# EAGLE design SenseBox-MCU-2-1 (EAGLE 9.6.2)

## Sheet 1 of 2
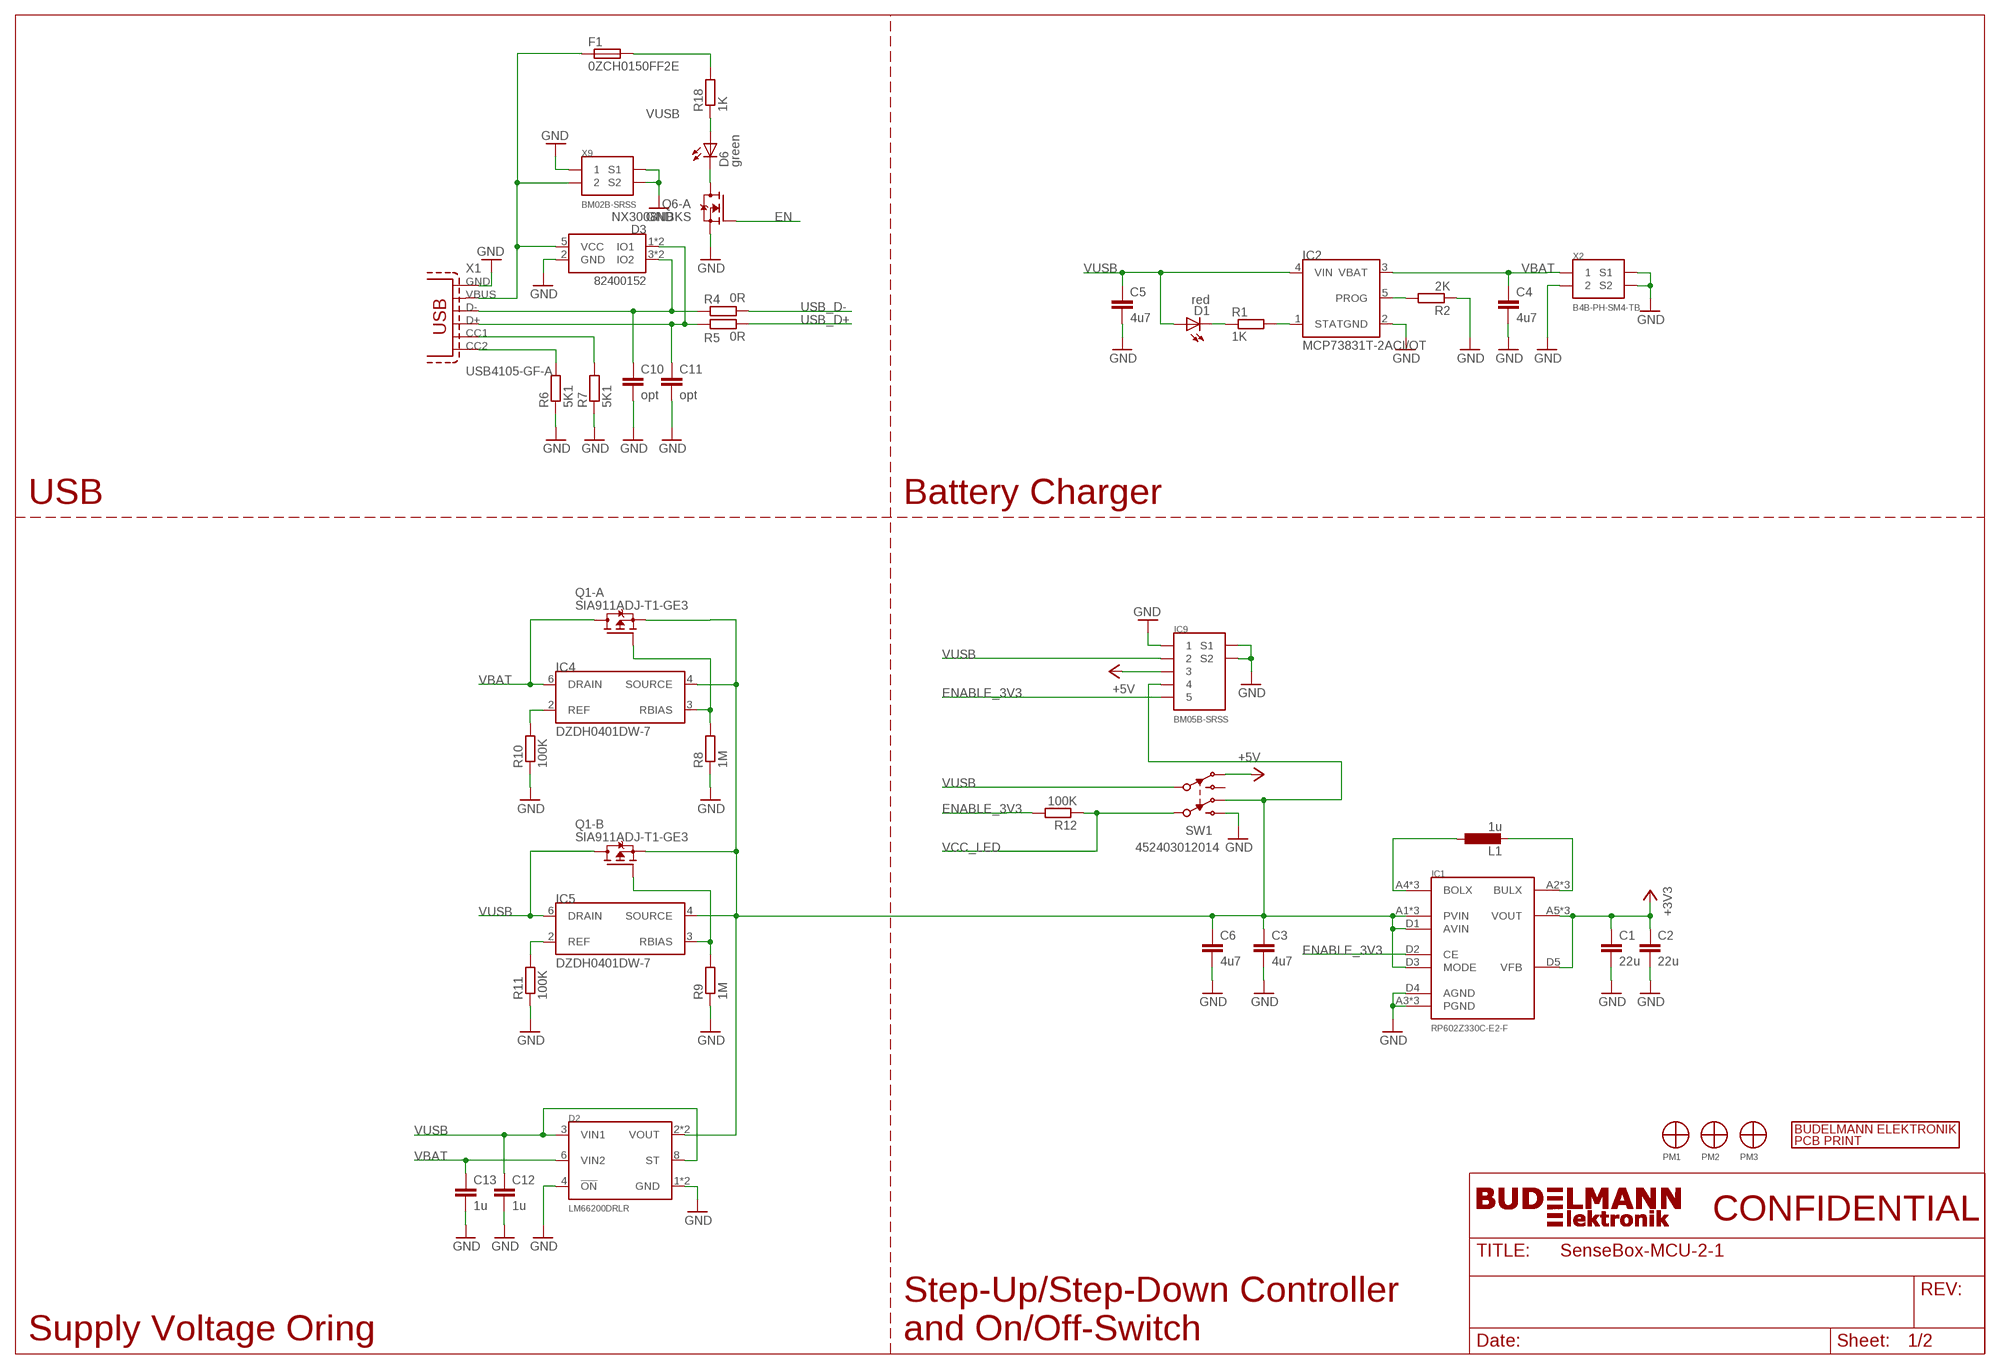
[diagram p0: schematic, sheet 1]

### Parts
C1  22u  C_22U_0805N  [0805N]
C2  22u  C_22U_0805N  [0805N]
C3  4u7  C_4U7_0603N  [0603N]
C4  4u7  C_4U7_0603N  [0603N]
C5  4u7  C_4U7_0603N  [0603N]
C6  4u7  C_4U7_0603N  [0603N]
C10  opt  C_0402N  [0402N]
C11  opt  C_0402N  [0402N]
C12  1u  C_1U_0402N  [0402N]
C13  1u  C_1U_0402N  [0402N]
D1  red  LED_RED_0603N  [0603N]
D2  LM66200DRLR  LM66200  [SOT-5X3]
D3  82400152  TVS-3-CHANNELS_WE-TVS_SOT563  [SOT563]
D6  green  LED_GREEN_0603N  [0603N]
F1  0ZCH0150FF2E  FUSE-2PIN_1.5A_1210N  [1210N]
IC1  RP602Z330C-E2-F  RP602_RP602Z330C-E2-F_WLCSP-20-P1  [WLCSP-20-P1]
IC2  MCP73831T-2ACI/OT  MCP73831_MCP73831T-2ACI/OT_SOT23-5  [SOT23-5]
IC4  DZDH0401DW-7  DZDH0401DW  [SOT363]
IC5  DZDH0401DW-7  DZDH0401DW  [SOT363]
IC9  BM05B-SRSS  SH-05_BM05B-SRSS_BM05B-SRSS  [BM05B-SRSS]
L1  1u  L_WE-LQS-1U_5040  [5040]
PM1  PM_ASSEMBLY  [PM1]
PM2  PM_ASSEMBLY  [PM1]
PM3  PM_ASSEMBLY  [PM1]
Q1  SIA911ADJ-T1-GE3  MOSFET-P-DUAL_SIA911ADJ-T1-GE3_POWERPAK-SC70-6  [POWERPAK-SC70-6]
Q6  NX3008NBKS  MOSFET-N-DUAL_NX3008NBKS_SOT363  [SOT363]
R1  1K  R_1K_0402N  [0402N]
R2  2K  R_2K_0402N  [0402N]
R4  0R  R_0R_0402N  [0402N]
R5  0R  R_0R_0402N  [0402N]
R6  5K1  R_5K1_0402N  [0402N]
R7  5K1  R_5K1_0402N  [0402N]
R8  1M  R_1M_0402N  [0402N]
R9  1M  R_1M_0402N  [0402N]
R10  100K  R_100K_0402N  [0402N]
R11  100K  R_100K_0402N  [0402N]
R12  100K  R_100K_0402N  [0402N]
R18  1K  R_1K_0402N  [0402N]
SW1  452403012014  DPDT_WS-SLSV  [WS-SLSV]
U$3  BE_LOGO_10MM_T  [BE_TOP_10MM]
X1  USB4105-GF-A  USB-C-2.0_USB4105-GF-A_USB4105  [USB4105]
X2  B4B-PH-SM4-TB  SH-02_B4B-PH-SM4-TB_B4B-PH-SM4-TB  [B4B-PH-SM4-TB]
X9  BM02B-SRSS  SH-02_BM02B-SRSS_BM02B-SRSS  [BM02B-SRSS]

### Nets
+3V3: C1.1 C2.1 IC1.A5(VOUT) IC1.B5(VOUT) IC1.C5(VOUT) IC1.D5(VFB) ; also sheet 2
+5V: IC9.3 SW1.3(NC1)
EN: Q6.2(-A:G) ; also sheet 2
ENABLE_3V3: IC1.D2(CE) IC9.5 R12.2
GND: C1.2 C2.2 C3.2 C4.2 C5.2 C6.2 C10.2 C11.2 C12.2 C13.2 D2.1(GND) D2.4(!ON) D2.5(GND) D3.2(GND) IC1.A3(PGND) IC1.B3(PGND) IC1.C3(PGND) IC1.D4(AGND) IC2.2(GND) IC9.1 IC9.S1 IC9.S2 Q6.1(-A:S) R2.1 R6.1 R7.1 R8.1 R9.1 R10.1 R11.1 SW1.4(NO2) X1.A1_B12(GND) X1.B1_A12(GND) X1.S1(GND) X1.S2(GND) X1.S3(GND) X1.S4(GND) X2.2 X2.SH1(S1) X2.SH2(S2) X9.1 X9.S1 X9.S2 ; also sheet 2
N$1: IC1.A4(BOLX) IC1.B4(BOLX) IC1.C4(BOLX) L1.1
N$2: IC1.A2(BULX) IC1.B2(BULX) IC1.C2(BULX) L1.2
N$4: IC2.5(PROG) R2.2
N$6: IC4.2(REF) R10.2
N$7: D1.C R1.1
N$8: IC2.1(STAT) R1.2
N$9: C10.1 D3.3(IO2) D3.4(IO2) R4.1 X1.A7(D-) X1.B7(D-)
N$10: C11.1 D3.1(IO1) D3.6(IO1) R5.1 X1.A6(D+) X1.B6(D+)
N$11: R6.2 X1.B5(CC2)
N$12: R7.2 X1.A5(CC1)
N$13: D3.5(VCC) F1.1 X1.A4_B9(VBUS) X1.B4_A9(VBUS) X9.2
N$14: IC5.2(REF) R11.2
N$15: IC4.3(RBIAS) Q1.2(-A:G) R8.2
N$16: C3.1 C6.1 D2.2(VOUT) D2.7(VOUT) IC1.A1(PVIN) IC1.B1(PVIN) IC1.C1(PVIN) IC1.D1(AVIN) IC1.D3(MODE) IC4.4(SOURCE) IC5.4(SOURCE) IC9.4 Q1.1(-A:S) Q1.4(-B:S) SW1.6(NC2)
N$17: IC5.3(RBIAS) Q1.5(-B:G) R9.2
N$27: D6.A R18.1
N$42: D6.C Q6.6(-A:D)
USB_D+: R5.2 ; also sheet 2
USB_D-: R4.2 ; also sheet 2
VBAT: C4.1 C13.1 D2.6(VIN2) IC2.3(VBAT) IC4.6(DRAIN) Q1.6(-A:D) Q1.7(-A:D) X2.1
VCC_LED: R12.1 SW1.5(C2) ; also sheet 2
VUSB: C5.1 C12.1 D1.A D2.3(VIN1) D2.8(ST) F1.2 IC2.4(VIN) IC5.6(DRAIN) IC9.2 Q1.3(-B:D) Q1.8(-B:D) R18.2 SW1.2(C1)
Unconnected: SW1.1(NO1)

### Notes on the sheet
- USB | Battery Charger
- Supply Voltage Oring
- Step-Up/Step-Down Controller 
  and On/Off-Switch

## Sheet 2 of 2
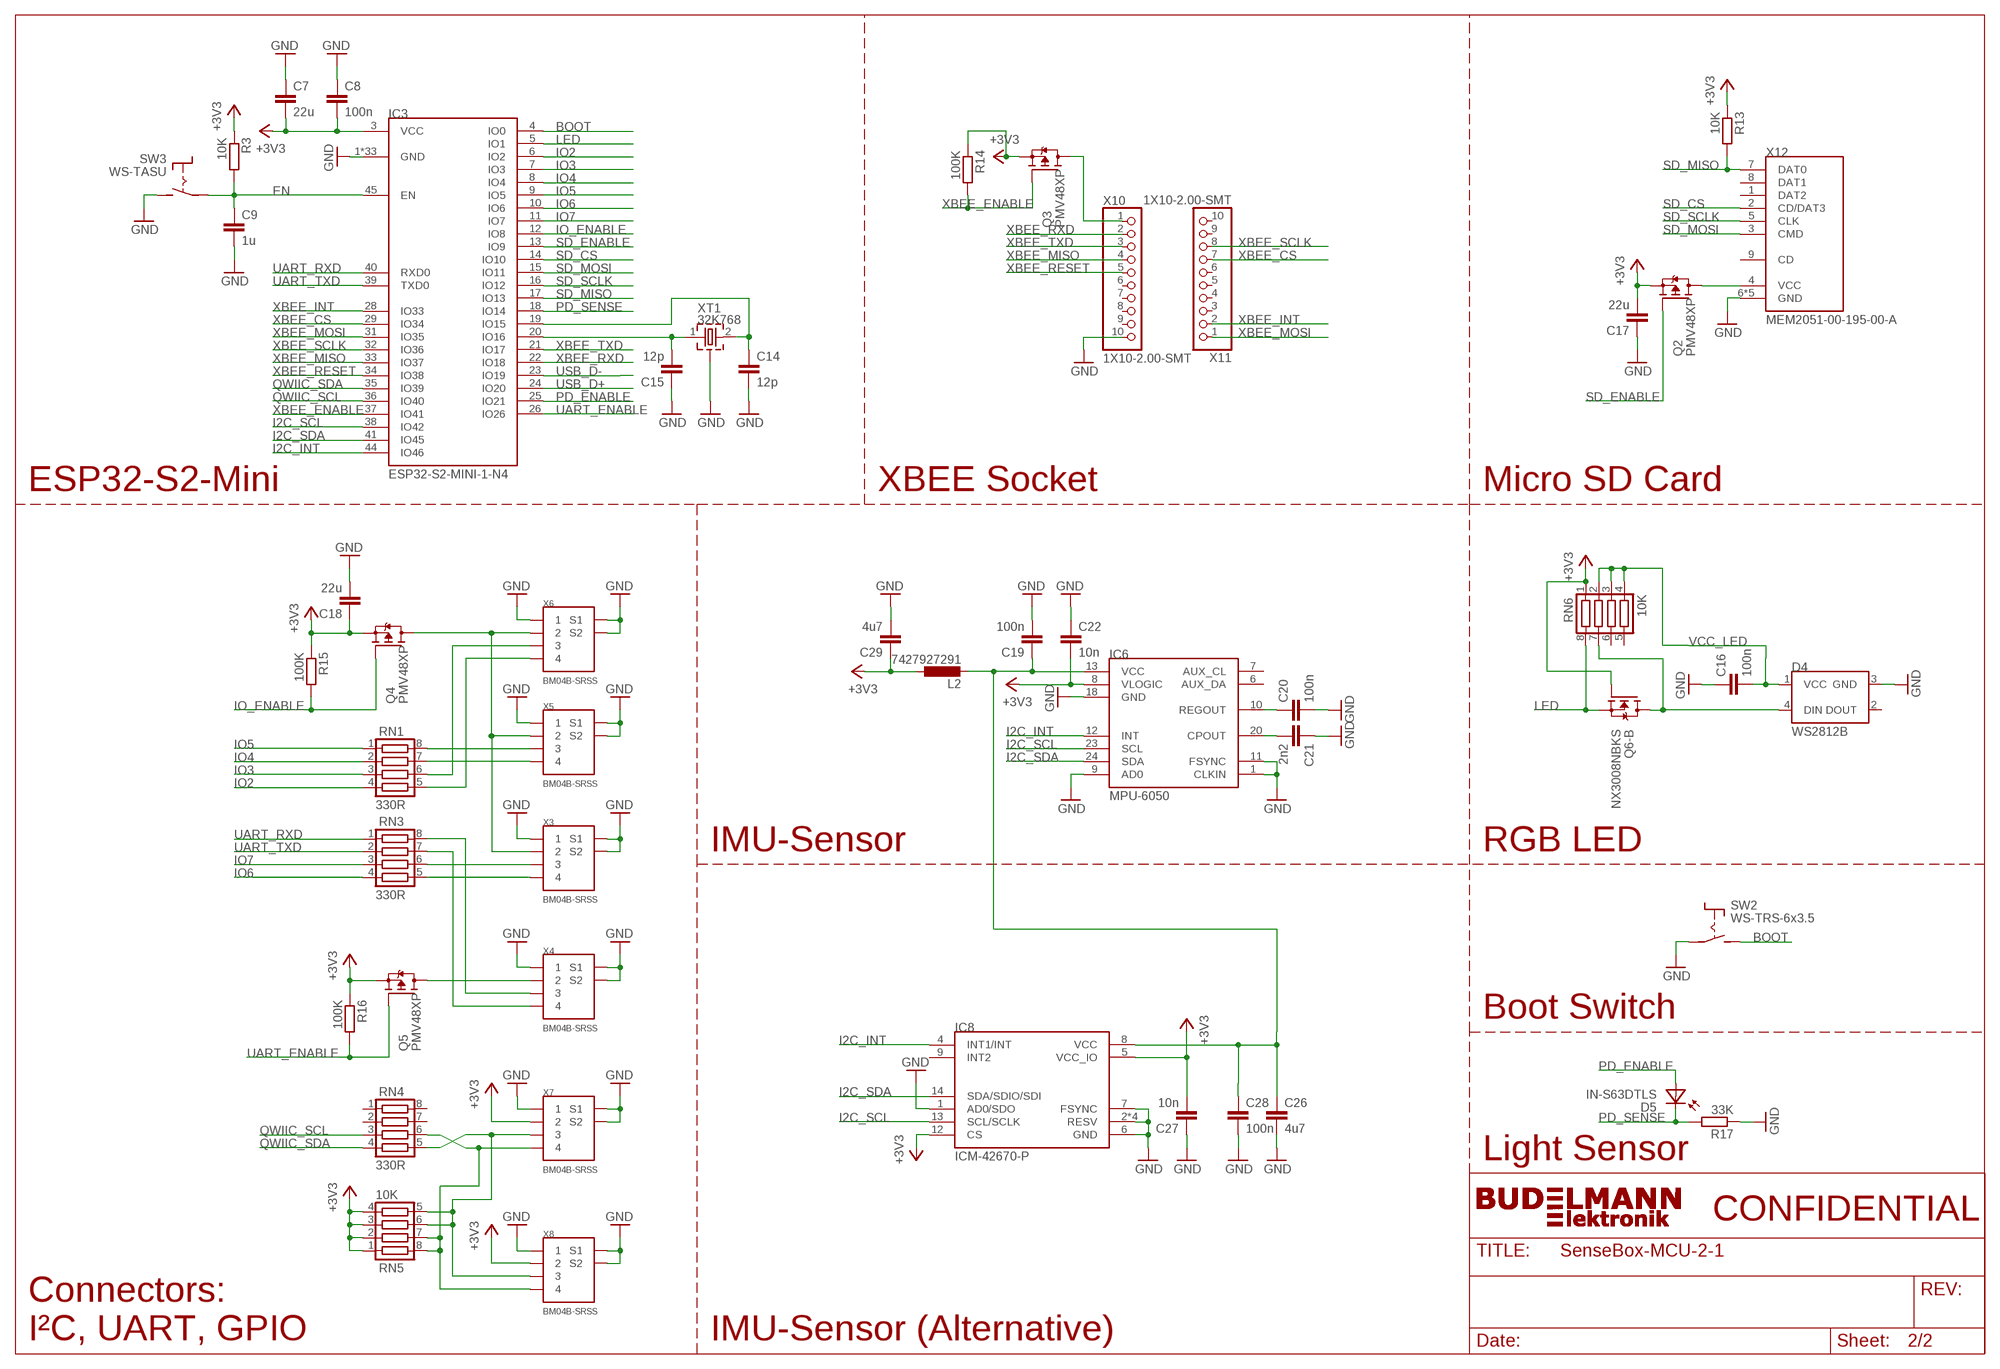
[diagram p1: schematic, sheet 2]

### Parts
C7  22u  C_22U_0805N  [0805N]
C8  100n  C_100N_0402N  [0402N]
C9  1u  C_1U_0402N  [0402N]
C14  12p  C_12P_0402N  [0402N]
C15  12p  C_12P_0402N  [0402N]
C16  100n  C_100N_0402N  [0402N]
C17  22u  C_22U_0805N  [0805N]
C18  22u  C_22U_0805N  [0805N]
C19  100n  C_100N_0402N  [0402N]
C20  100n  C_100N_0402N  [0402N]
C21  2n2  C_2N2_0402N  [0402N]
C22  10n  C_10N_0402N  [0402N]
C26  4u7  C_4U7_0603N  [0603N]
C27  10n  C_10N_0402N  [0402N]
C28  100n  C_100N_0402N  [0402N]
C29  4u7  C_4U7_0603N  [0603N]
D4  WS2812B  LED-ADRESSABLE_WS2812B_5050  [5050]
D5  IN-S63DTLS  PHOTODIODE_IN-S63DTLS_0603N  [0603N]
IC3  ESP32-S2-MINI-1-N4  ESP32-S2-MINI_ESP32-S2-MINI-1-N4_ESP32-S2-MINI  [ESP32-S2-MINI]
IC6  MPU-6050  [QFN24_4X4]
IC8  ICM-42670-P  ICM-42670-P_LGA14_2.5X3  [LGA14_2.5X3]
L2  7427927291  L_WE-CBF-7427927291_0402N  [0402N]
Q2  PMV48XP  MOSFET-P_PMV48XP_SOT23'  [SOT23]
Q3  PMV48XP  MOSFET-P_PMV48XP_SOT23'  [SOT23]
Q4  PMV48XP  MOSFET-P_PMV48XP_SOT23'  [SOT23]
Q5  PMV48XP  MOSFET-P_PMV48XP_SOT23'  [SOT23]
R3  10K  R_10K_0402N  [0402N]
R13  10K  R_10K_0402N  [0402N]
R14  100K  R_100K_0402N  [0402N]
R15  100K  R_100K_0402N  [0402N]
R16  100K  R_100K_0402N  [0402N]
R17  33K  R_33K_0402N  [0402N]
RN1  330R  RN4_330R_CAY16  [CAY16]
RN3  330R  RN4_330R_CAY16  [CAY16]
RN4  330R  RN4_330R_CAY16  [CAY16]
RN5  10K  RN4_10K_CAY16  [CAY16]
RN6  10K  RN4_10K_CAY16  [CAY16]
SW2  WS-TRS-6x3.5  TACTILE_SWITCH_WS-TRS-6X3.5  [WS-TRS-6X3.5]
SW3  WS-TASU  TACTILE_SWITCH_WS-TASU  [WS-TASU]
X3  BM04B-SRSS  SH-04_BM04B-SRSS_BM04B-SRSS  [BM04B-SRSS]
X4  BM04B-SRSS  SH-04_BM04B-SRSS_BM04B-SRSS  [BM04B-SRSS]
X5  BM04B-SRSS  SH-04_BM04B-SRSS_BM04B-SRSS  [BM04B-SRSS]
X6  BM04B-SRSS  SH-04_BM04B-SRSS_BM04B-SRSS  [BM04B-SRSS]
X7  BM04B-SRSS  SH-04_BM04B-SRSS_BM04B-SRSS  [BM04B-SRSS]
X8  BM04B-SRSS  SH-04_BM04B-SRSS_BM04B-SRSS  [BM04B-SRSS]
X10  1X10-2.00-SMT  1X10_2.00-SMT  [1X10-2.00-SMD]
X11  1X10-2.00-SMT  1X10_2.00-SMT  [1X10-2.00-SMD]
X12  MEM2051-00-195-00-A  SD-CARD2_MEM2051  [MEM2051]
XT1  32K768  CRYSTAL-1GND_1.4X1.5X5.2  [1.4X1.5X5.2]

### Nets
+3V3: C7.2 C8.2 C17.2 C18.1 C22.2 C27.2 C29.1 IC3.3(VCC) IC6.8(VLOGIC) IC8.5(VCC_IO) IC8.12(CS) L2.1 Q2.2(S) Q3.2(S) Q4.2(S) Q5.2(S) Q6.5(-B:G) R3.1 R13.1 R14.1 R15.1 R16.1 RN5.1 RN5.2 RN5.3 RN5.4 RN6.1 X7.2 X8.2 ; also sheet 1
BOOT: IC3.4(IO0) SW2.2(S)
EN: C9.1 IC3.45(EN) R3.2 SW3.1(P) SW3.3(P) ; also sheet 1
GND: C7.1 C8.1 C9.2 C14.2 C15.1 C16.1 C17.1 C18.2 C19.2 C20.2 C21.1 C22.1 C26.2 C27.1 C28.2 C29.2 D4.3(GND) IC3.1(GND) IC3.2(GND) IC3.30(GND) IC3.42(GND) IC3.43(GND) IC3.46(GND) IC3.47(GND) IC3.48(GND) IC3.49(GND) IC3.50(GND) IC3.51(GND) IC3.52(GND) IC3.53(GND) IC3.54(GND) IC3.55(GND) IC3.56(GND) IC3.57(GND) IC3.58(GND) IC3.59(GND) IC3.60(GND) IC3.61(GND) IC3.62(GND) IC3.63(GND) IC3.64(GND) IC3.65(GND) IC3.66(GND) IC3.67(GND) IC3.68(GND) IC3.69(GND) IC3.70(GND) IC3.71(GND) IC3.72(GND) IC3.73(GND) IC6.1(CLKIN) IC6.9(AD0) IC6.11(FSYNC) IC6.18(GND) IC8.1(AD0/SDO) IC8.2(RESV) IC8.3(RESV) IC8.6(GND) IC8.7(FSYNC) IC8.10(RESV) IC8.11(RESV) R17.1 SW2.1(P) SW3.2(S) SW3.4(S) X3.1 X3.S1 X3.S2 X4.1 X4.S1 X4.S2 X5.1 X5.S1 X5.S2 X6.1 X6.S1 X6.S2 X7.1 X7.S1 X7.S2 X8.1 X8.S1 X8.S2 X10.10 X12.6(GND) X12.S1(GND) X12.S2(GND) X12.S3(GND) X12.S4(GND) XT1.3(GND) ; also sheet 1
I2C_INT: IC3.44(IO46) IC6.12(INT) IC8.4(INT1/INT)
I2C_SCL: IC3.38(IO42) IC6.23(SCL) IC8.13(SCL/SCLK)
I2C_SDA: IC3.41(IO45) IC6.24(SDA) IC8.14(SDA/SDIO/SDI)
IO2: IC3.6(IO2) RN1.4
IO3: IC3.7(IO3) RN1.3
IO4: IC3.8(IO4) RN1.2
IO5: IC3.9(IO5) RN1.1
IO6: IC3.10(IO6) RN3.4
IO7: IC3.11(IO7) RN3.3
IO_ENABLE: IC3.12(IO8) Q4.1(G) R15.2
LED: IC3.5(IO1) Q6.4(-B:S) RN6.8
N$3: RN1.6 X6.3
N$5: C15.2 IC3.20(IO16) XT1.1
N$18: C14.1 IC3.19(IO15) XT1.2
N$19: D4.4(DIN) Q6.3(-B:D) RN6.7
N$20: Q4.3(D) X3.2 X5.2 X6.2
N$21: C20.1 IC6.10(REGOUT)
N$22: Q2.3(D) X12.4(VCC)
N$23: Q3.3(D) X10.1
N$24: Q5.3(D) X4.2
N$25: C21.2 IC6.20(CPOUT)
N$31: RN1.5 X6.4
N$32: RN1.8 X5.3
N$33: RN1.7 X5.4
N$34: RN3.5 X3.4
N$35: RN3.6 X3.3
N$36: RN3.8 X4.3
N$37: RN3.7 X4.4
N$38: RN4.6 RN5.7 RN5.8 X7.4 X8.4
N$39: RN4.5 RN5.5 RN5.6 X7.3 X8.3
N$41: C19.1 C26.1 C28.1 IC6.13(VCC) IC8.8(VCC) L2.2
PD_ENABLE: D5.A IC3.25(IO21)
PD_SENSE: D5.C IC3.18(IO14) R17.2
QWIIC_SCL: IC3.36(IO40) RN4.3
QWIIC_SDA: IC3.35(IO39) RN4.4
SD_CS: IC3.14(IO10) X12.2(CD/DAT3)
SD_ENABLE: IC3.13(IO9) Q2.1(G)
SD_MISO: IC3.17(IO13) R13.2 X12.7(DAT0)
SD_MOSI: IC3.15(IO11) X12.3(CMD)
SD_SCLK: IC3.16(IO12) X12.5(CLK)
UART_ENABLE: IC3.26(IO26) Q5.1(G) R16.2
UART_RXD: IC3.40(RXD0) RN3.1
UART_TXD: IC3.39(TXD0) RN3.2
USB_D+: IC3.24(IO20) ; also sheet 1
USB_D-: IC3.23(IO19) ; also sheet 1
VCC_LED: C16.2 D4.1(VCC) RN6.2 RN6.3 RN6.4 ; also sheet 1
XBEE_CS: IC3.29(IO34) X11.7
XBEE_ENABLE: IC3.37(IO41) Q3.1(G) R14.2
XBEE_INT: IC3.28(IO33) X11.2
XBEE_MISO: IC3.33(IO37) X10.4
XBEE_MOSI: IC3.31(IO35) X11.1
XBEE_RESET: IC3.34(IO38) X10.5
XBEE_RXD: IC3.22(IO18) X10.2
XBEE_SCLK: IC3.32(IO36) X11.8
XBEE_TXD: IC3.21(IO17) X10.3
Unconnected: D4.2(DOUT) IC6.6(AUX_DA) IC6.7(AUX_CL) IC8.9(INT2) RN4.1 RN4.2 RN4.7 RN4.8 RN6.5 RN6.6 X10.6 X10.7 X10.8 X10.9 X11.3 X11.4 X11.5 X11.6 X11.9 X11.10 X12.1(DAT2) X12.8(DAT1) X12.9(CD)

### Notes on the sheet
- ESP32-S2-Mini | XBEE Socket | Micro SD Card
- IMU-Sensor | RGB LED
- Boot Switch
- Light Sensor
- Connectors:
  I²C, UART, GPIO
- IMU-Sensor (Alternative)

## Library data of the parts
C1 C2 C7 C17 C18 = BE_capacitor:C: Capacitor; BE#: 208; DIELECTRIC: X5R; VOLTAGE: 6V3
C3-C6 C26 C29 = BE_capacitor:C: Capacitor; BE#: 284; DIELECTRIC: X5R; VOLTAGE: 6V3
C8 C16 C19 C20 C28 = BE_capacitor:C: Capacitor; BE#: 756; DIELECTRIC: X7R; VOLTAGE: 16
C9 C12 C13 = BE_capacitor:C: Capacitor; BE#: 901; DIELECTRIC: X5R; VOLTAGE: 10
C10 C11 = BE_capacitor:C: Capacitor; BE#: 0
C14 C15 = BE_capacitor:C: Capacitor; BE#: 754; DIELECTRIC: NPO; VOLTAGE: 50
C21 = BE_capacitor:C: Capacitor; BE#: 752; DIELECTRIC: X7R; VOLTAGE: 50
C22 C27 = BE_capacitor:C: Capacitor; BE#: 617; DIELECTRIC: X7R; VOLTAGE: 25
D1 = BE_opto:LED: Single LED; BE#: 224
D2 = BE_diode:LM66200: LM66200 1.6-5V, 2.5A Dual Ideal Diode with Automatic Switchover; BE#: 2291
D3 = BE_diode:TVS-3-CHANNELS: TVS Suppressor Diodes Array; BE#: 2015
D4 = BE_opto:LED-ADRESSABLE: Adressable LED with Data-In and Data-Out Pins; BE#: 2295
D5 = BE_opto:PHOTODIODE: Photo diode; BE#: 2296
D6 = BE_opto:LED: Single LED; BE#: 223
F1 = BE_fuse:FUSE-2PIN: Fuse with two Pins.; BE#: 2289; CURRENT: 1.5
IC1 = BE_dcdc:RP602: 1.5 A PWM/VFM Buck-Boost DC/DC Converter with Synchronous Rectifier; BE#: 2281
IC2 = BE_dcdc:MCP73831: Miniature Single-Cell, Fully Integrated Li-Ion, Li-Polymer Charge Management Controllers up to 500mA; BE#: 2283
IC3 = BE_wireless:ESP32-S2-MINI: 2.4 GHz Wi­Fi (802.11 b/g/n) module built around ESP32-S2 series of SoCs, Xtensa Single Core 32-bit LX7 Microprocessor; BE#: 2275
IC4 IC5 = BE_diode:DZDH0401DW: Ideal Diode Controller; BE#: 2290
IC6 = BE_sensor:MPU-6050: 6-Axis Inertial Measurement Unit Combining a 3-Axis Gyroscope and a 3-Axis Accelerometer; BE#: 2297
IC8 = BE_sensor:ICM-42670-P: high performance 6-axis MEMS MotionTracking IMU; BE#: 2357
IC9 = BE_connector:SH-05: SH Connector; BE#: 2369
L1 = BE_inductor:L: Inductor; BE#: 2282; CURRENT: 4.9; INDUCTANCE: 1u
L2 = BE_inductor:L: Inductor; BE#: 1925; CURRENT: 0.3
PM1-PM3 = BE_markers:PM: Passing Marker; BE#: 0
Q1 = BE_transistor:MOSFET-P-DUAL: Dual Mosfet with Common Drain Pins; BE#: 2292; CURRENT: 4.5; VOLTAGE: 20
Q2-Q5 = BE_transistor:MOSFET-P: Single P-Channel Mosfet; BE#: 271; CURRENT: 3.5; VOLTAGE: 20
Q6 = BE_transistor:MOSFET-N-DUAL: Dual Mosfet; BE#: 405; CURRENT: 0.35; POWER: 0.3; VOLTAGE: 30
R1 R18 = BE_resistor:R: Resistor; BE#: 1088; POWER: 0.063; TEMPERATURE_COEFFICIENT: 100; TOLERANCE: 1%; VOLTAGE: 50
R2 = BE_resistor:R: Resistor; BE#: 1057; POWER: 0.063; TEMPERATURE_COEFFICIENT: 100; TOLERANCE: 1%; VOLTAGE: 50
R3 R13 = BE_resistor:R: Resistor; BE#: 616; POWER: 0.063; TEMPERATURE_COEFFICIENT: 100; TOLERANCE: 1%; VOLTAGE: 50
R4 R5 = BE_resistor:R: Resistor; BE#: 1054
R6 R7 = BE_resistor:R: Resistor; BE#: 2285; POWER: 0.063; TEMPERATURE_COEFFICIENT: 100; TOLERANCE: 1%; VOLTAGE: 50
R8 R9 = BE_resistor:R: Resistor; BE#: 1089; POWER: 0.063; TEMPERATURE_COEFFICIENT: 100; TOLERANCE: 1%; VOLTAGE: 50
R10-R12 R14-R16 = BE_resistor:R: Resistor; BE#: 615; POWER: 0.063; TEMPERATURE_COEFFICIENT: 100; TOLERANCE: 1%; VOLTAGE: 50
R17 = BE_resistor:R: Resistor; BE#: 1428; POWER: 0.063; TEMPERATURE_COEFFICIENT: 100; TOLERANCE: 1%; VOLTAGE: 50
RN1 RN3 RN4 = BE_resistor:RN4: Quad Resistor Net; BE#: 483; POWER: 0.062; TOLERANCE: 5%; VOLTAGE: 50
RN5 RN6 = BE_resistor:RN4: Quad Resistor Net; BE#: 196; POWER: 0.062; TOLERANCE: 5%; VOLTAGE: 50
SW1 = BE_switch:DPDT: Switch - Double Pole, Double Throw; BE#: 2294
SW2 = BE_switch:TACTILE_SWITCH: Tactile Switch; BE#: 272
SW3 = BE_switch:TACTILE_SWITCH: Tactile Switch; BE#: 778
U$3 = BE_logo:BE_LOGO: Budelmann Elektronik Logo for pcb print in different sizes.; BE#: 0
X1 = BE_connector:USB-C-2.0: USB-C Connector with USB 2.0 Support; BE#: 2284
X2 = BE_connector:SH-02: SH Connector; BE#: 2370
X3-X8 = BE_connector:SH-04: SH Connector; BE#: 2287
X9 = BE_connector:SH-02: SH Connector; BE#: 2286
X10 X11 = BE_pinheader:1X10: Pin Header; BE#: 2288
X12 = BE_connector:SD-CARD2: SD Card with Card Detection (Single Pin Contacting GND); BE#: 2293
XT1 = BE_crystal:CRYSTAL-1GND: Crystal with one Ground Terminal; BE#: 830

## Board
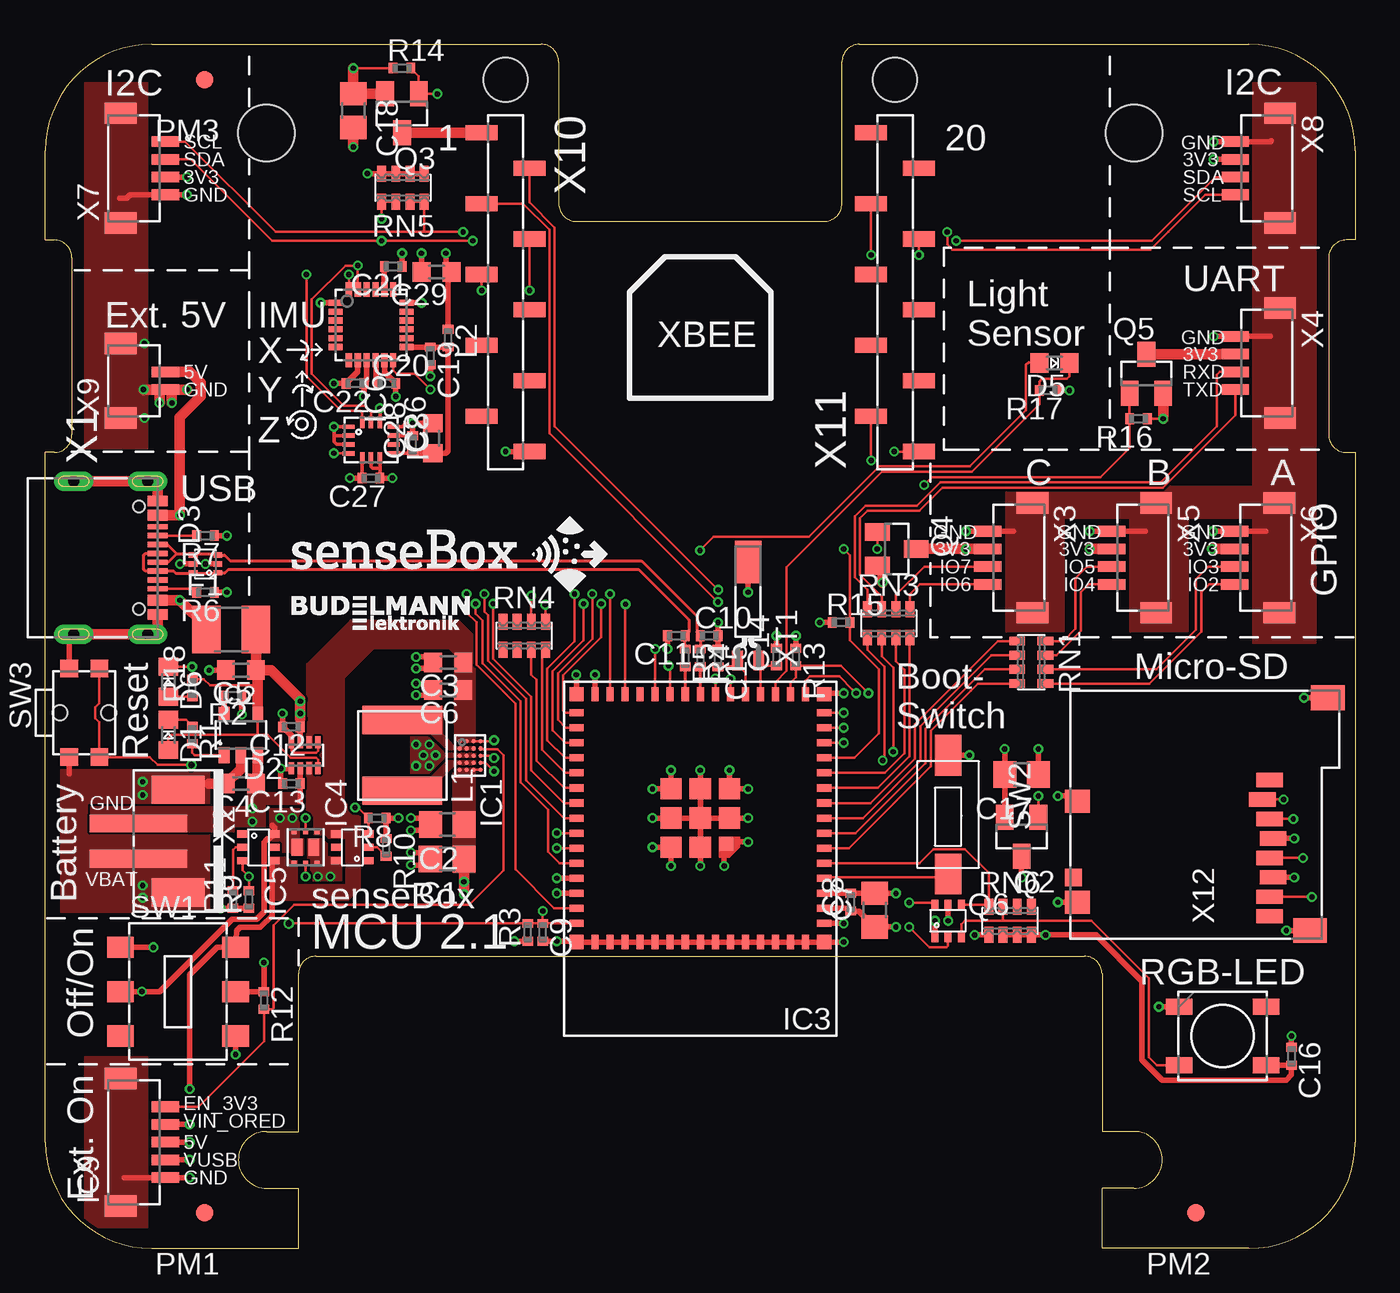
[diagram p2: board, top side]
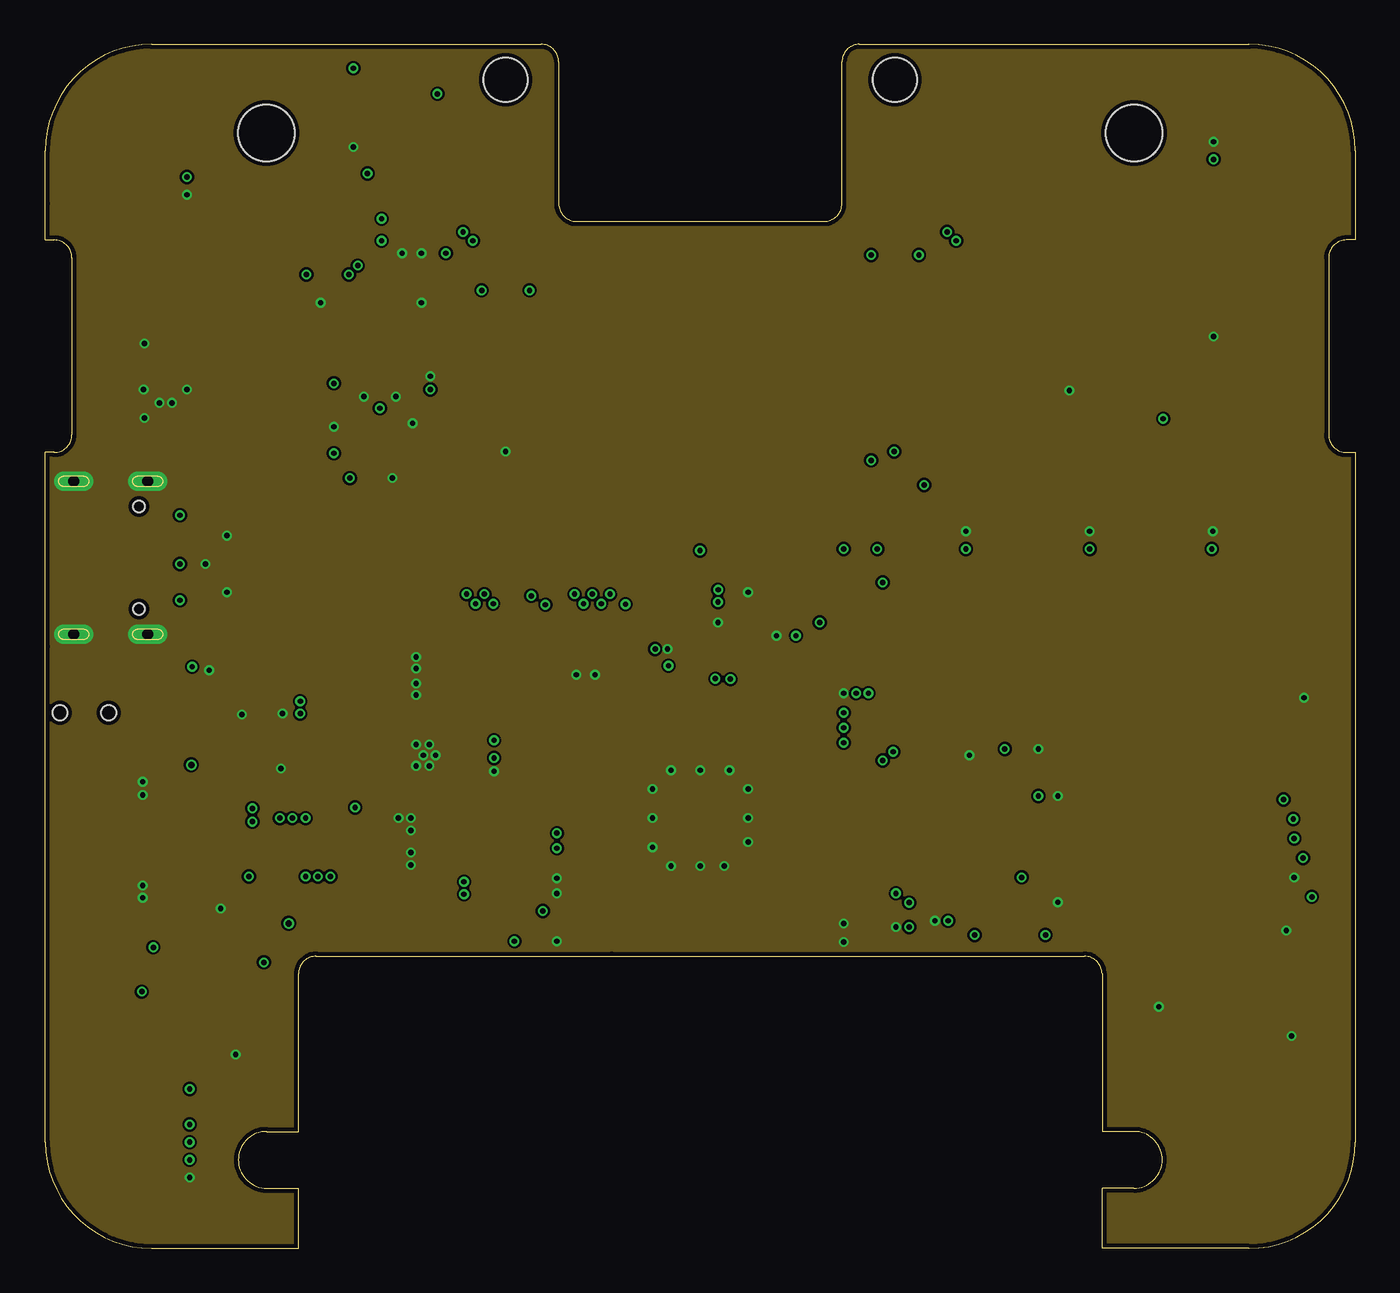
[diagram p3: board, inner layer Route2]
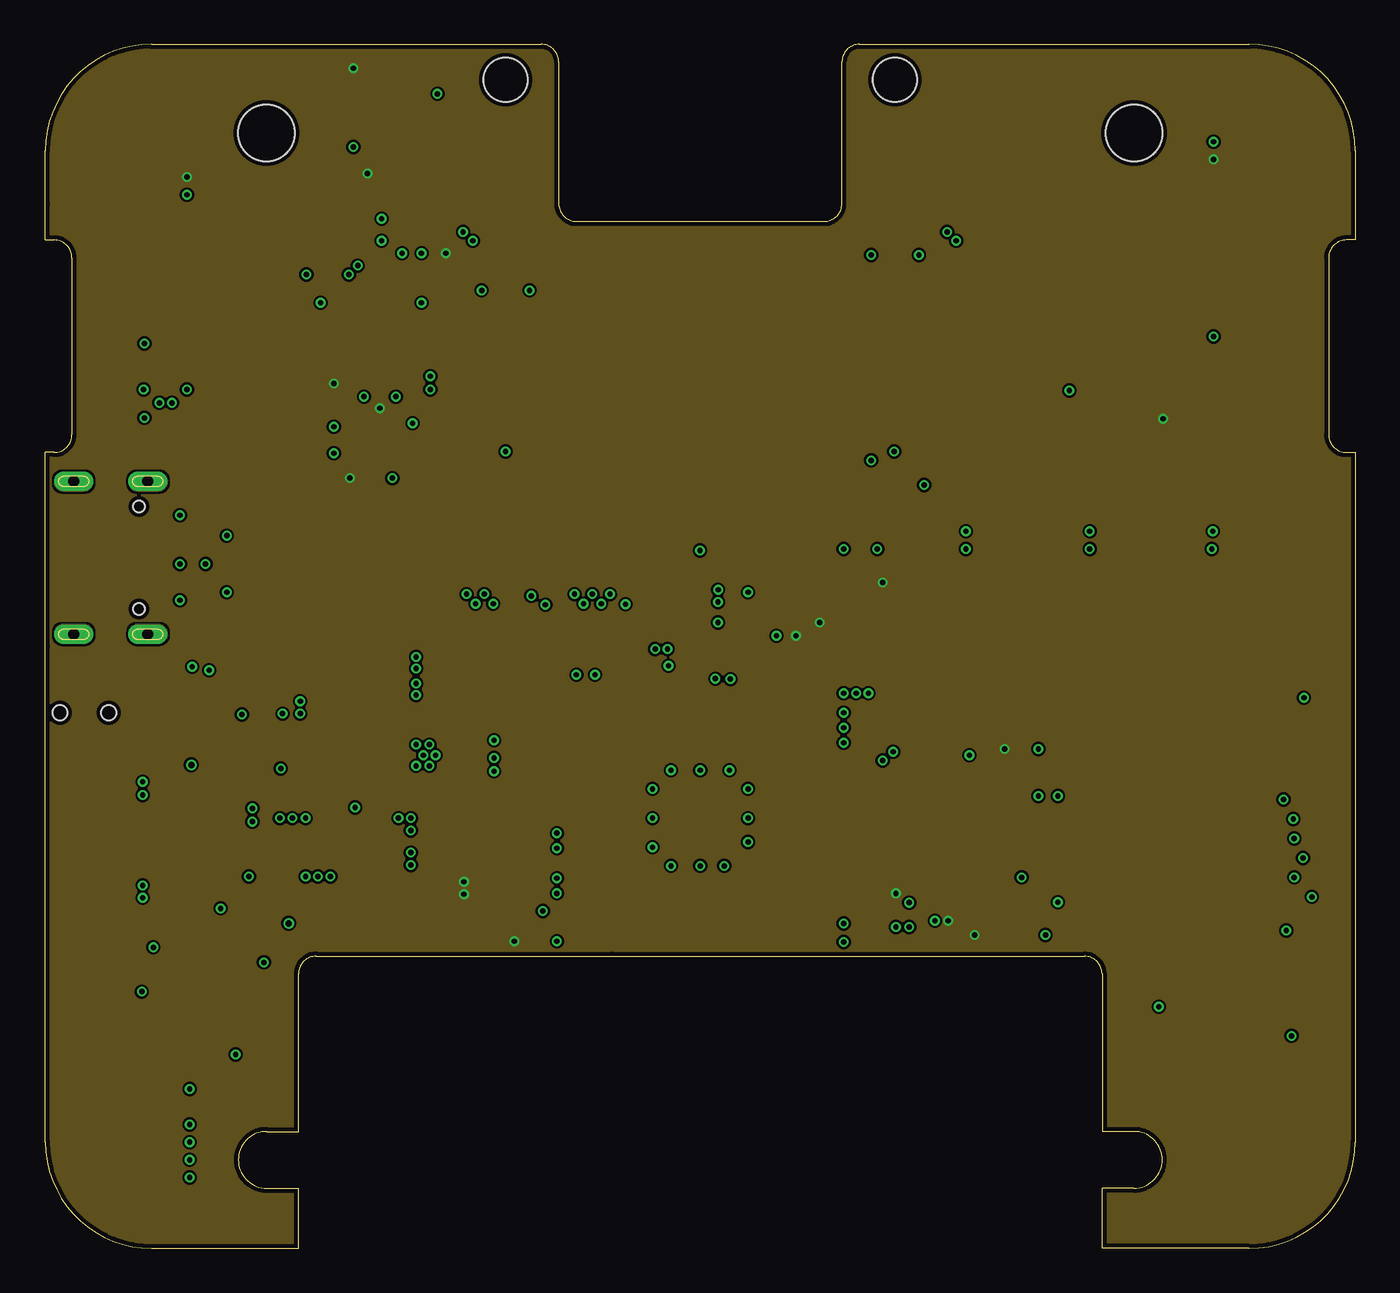
[diagram p4: board, inner layer Route15]
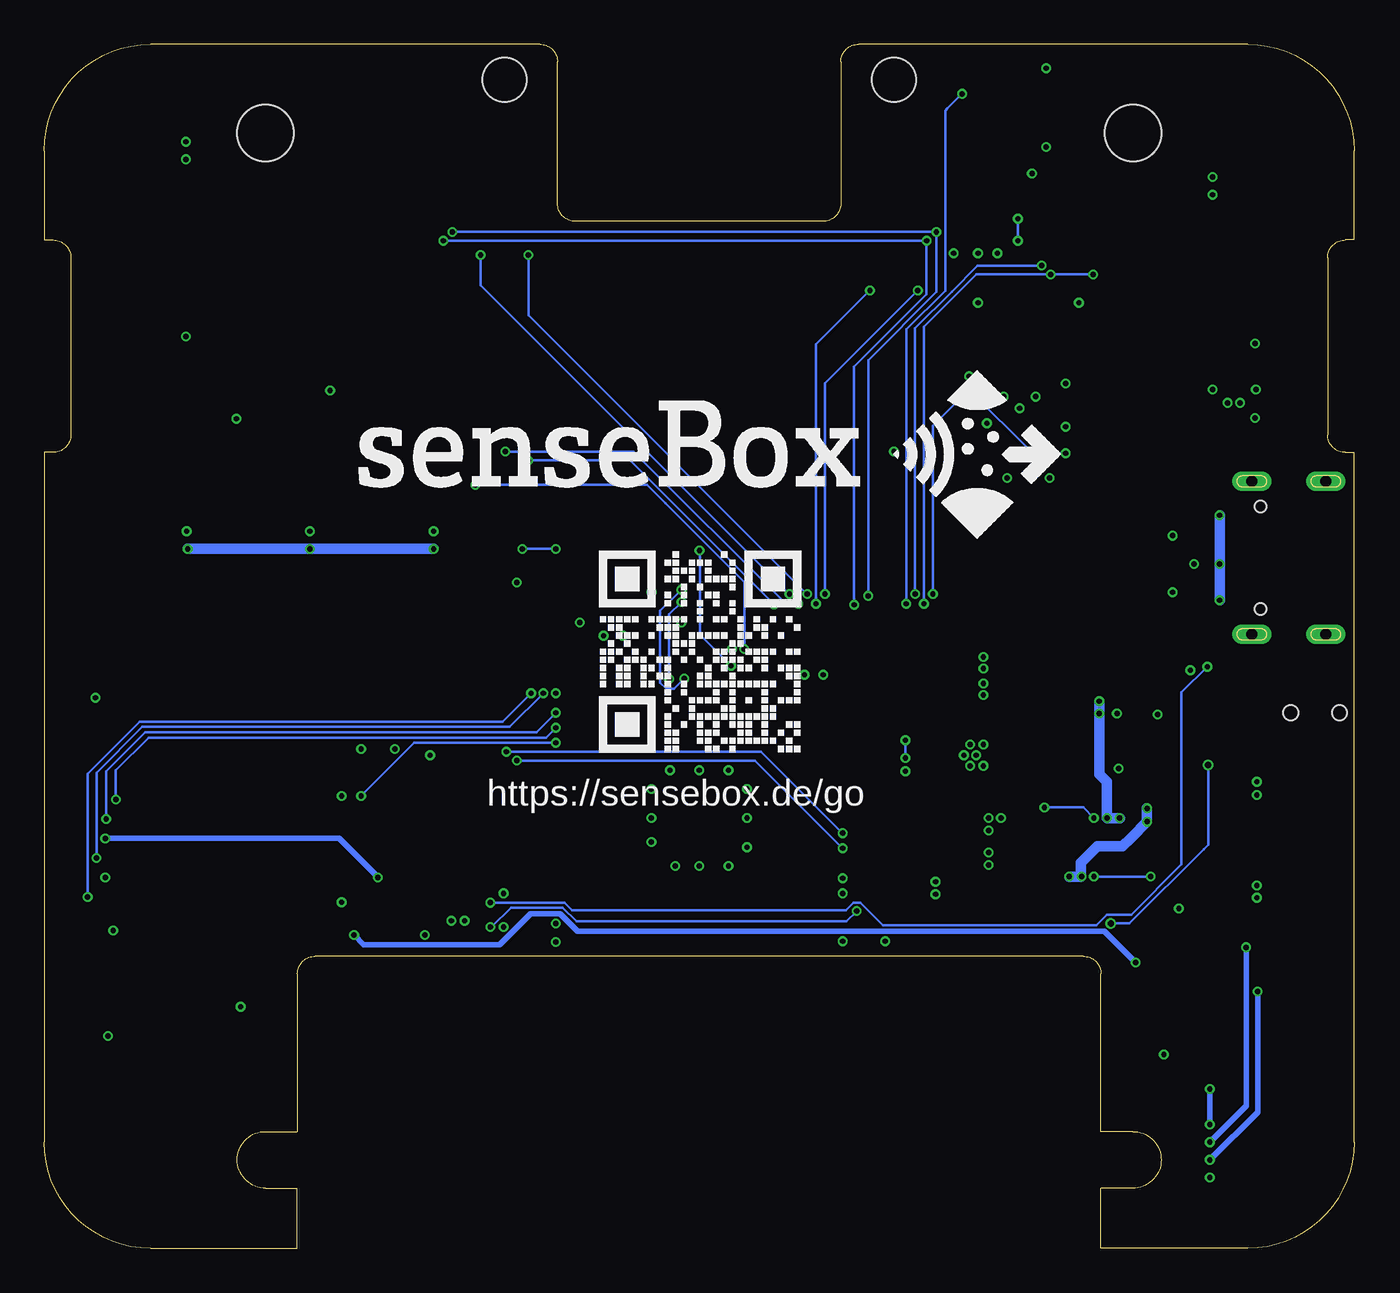
[diagram p5: board, bottom side, seen from below]

Size 74 x 68 mm. Coordinates in mm from the lower left corner, seen from the top.
Outline: 0,34 0,44.95 0.05,44.95 0.5,44.95 arc90 1.5,45.95 1.5,55.95 arc90 0.5,56.95 0,56.95 0,59 0,62 arc-90 6,68 28,68 arc-90 29,67 29,59 arc90 30,58 44,58 arc90 45,59 45,67 arc-90 46,68 68,68 arc-90 74,62 74,56.95 73.5,56.95 arc90 72.5,55.95 72.5,45.95 arc90 73.5,44.95 74,44.95 74,6 arc-90 68,0 59.7,0 59.7,3.4 61.5,3.4 arc90 63.1,5 arc90 61.5,6.6 59.7,6.6 59.7,15.5 arc90 58.7,16.5 32,16.5 15.3,16.5 arc90 14.3,15.5 14.3,6.6 12.5,6.6 arc90 10.9,5 arc90 12.5,3.4 14.3,3.4 14.3,0.1 14.3,0 10.55,0 6,0 arc-90 0,6 0,34
Copper layers (1+2*15+16): Top 0.035mm / dielectric 0.1mm / Route2 0.0175mm / dielectric 1.265mm / Route15 0.0175mm / dielectric 0.1mm / Bottom 0.035mm
Design rules "default *": minimum track width 0.125mm, minimum drill 0.3mm, track to track 0.125mm, track to pad 0.125mm, pad to pad 0.125mm, via to via 0.125mm, smd to smd 0.125mm, copper to edge 0.25mm, drill to drill 0.25mm, minimum pad ring 10mil, minimum via ring 0.125mm, stop-mask expansion 4mil, vias tented up to drill 0.4mm, thermal gap 0.125mm
Holes 3.2 mm at 12.5,63 61.5,63
Holes 2.5 mm at 48,66 26,66
tKeepout: area 9.5,60 to 15.5,66; area 58.5,60 to 64.5,66; area 58.5,2 to 64.5,8; area 9.5,2 to 15.5,8

### Footprints (pad centres in the part's own frame; a part is rotated, then mirrored left to right if it is on the bottom)
0805N = smd 1.3 x 1.5: 1 -0.95,0; 2 0.95,0
0603N = smd 1 x 1.1: 1 -0.85,0; 2 0.85,0
0402N = smd 0.5 x 0.6: 1 -0.5,0; 2 0.5,0
0603N' = smd 1 x 1.1: A 0.85,0; C -0.85,0
SOT-5X3 = smd 0.3 x 0.67: 1 -0.75,-0.74; 2 -0.25,-0.74; 3 0.25,-0.74; 4 0.75,-0.74; 5 0.75,0.74; 6 0.25,0.74; 7 -0.25,0.74; 8 -0.75,0.74
SOT563 = smd 0.3 x 0.5: 1 -0.5,-0.7; 2 0,-0.7; 3 0.5,-0.7; 4 0.5,0.7; 5 0,0.7; 6 -0.5,0.7
5050 = smd 0.9 x 1.5: 1 -1.65,-2.45; 2 1.65,-2.45; 3 1.65,2.45; 4 -1.65,2.45
1210N = smd 1.6 x 2.7: 1 -1.4,0; 2 1.4,0
WLCSP-20-P1 = smd 0.265 x 0.265: A1 -0.8,-0.6; A2 -0.4,-0.6; A3 0,-0.6; A4 0.4,-0.6; A5 0.8,-0.6; B1 -0.8,-0.2; B2 -0.4,-0.2; B3 0,-0.2; B4 0.4,-0.2; B5 0.8,-0.2; C1 -0.8,0.2; C2 -0.4,0.2; C3 0,0.2; C4 0.4,0.2; C5 0.8,0.2; D1 -0.8,0.6; D2 -0.4,0.6; D3 0,0.6; D4 0.4,0.6; D5 0.8,0.6
SOT23-5 = smd 0.6 x 0.9: 1 -0.95,-1.15; 2 0,-1.15; 3 0.95,-1.15; 4 0.95,1.15; 5 -0.95,1.15
ESP32-S2-MINI = smd 0.4 x 0.8: 1 -3.65,-7; 2 -2.8,-7; 3 -1.95,-7; 4 -1.1,-7; 5 -0.25,-7; 6 0.6,-7; 7 1.45,-7; 8 2.3,-7; 9 3.15,-7; 10 4,-7; 11 4.85,-7; 12 5.7,-7; 13 6.55,-7; 14 7.4,-7; 15 8.25,-7; 31 8.25,7; 32 7.4,7; 33 6.55,7; 34 5.7,7; 35 4.85,7; 36 4,7; 37 3.15,7; 38 2.3,7; 39 1.45,7; 40 0.6,7; 41 -0.25,7; 42 -1.1,7; 43 -1.95,7; 44 -2.8,7; 45 -3.65,7 | smd 0.8 x 0.4: 16 9.3,-5.95; 17 9.3,-5.1; 18 9.3,-4.25; 19 9.3,-3.4; 20 9.3,-2.55; 21 9.3,-1.7; 22 9.3,-0.85; 23 9.3,0; 24 9.3,0.85; 25 9.3,1.7; 26 9.3,2.55; 27 9.3,3.4; 28 9.3,4.25; 29 9.3,5.1; 30 9.3,5.95; 46 -4.7,5.95; 47 -4.7,5.1; 48 -4.7,4.25; 49 -4.7,3.4; 50 -4.7,2.55; 51 -4.7,1.7; 52 -4.7,0.85; 53 -4.7,0; 54 -4.7,-0.85; 55 -4.7,-1.7; 56 -4.7,-2.55; 57 -4.7,-3.4; 58 -4.7,-4.25; 59 -4.7,-5.1; 60 -4.7,-5.95 | smd 1.2 x 1.2: 61 2.3,0; 67 2.3,-1.65; 68 3.95,-1.65; 69 3.95,0; 70 3.95,1.65; 71 2.3,1.65; 72 0.65,1.65; 73 0.65,0 | smd 0.8 x 0.8: 62 -4.7,-7; 63 9.3,-7; 64 9.3,7; 65 -4.7,7; 66 0.85,-1.45
SOT363 = smd 0.4 x 0.6: 1 -0.75,-0.9; 2 0,-0.9; 3 0.75,-0.9; 4 0.75,0.9; 5 0,0.9; 6 -0.75,0.9
QFN24_4X4 = smd 0.35 x 0.8: 1 -1.25,-2; 2 -0.75,-2; 3 -0.25,-2; 4 0.25,-2; 5 0.75,-2; 6 1.25,-2; 13 1.25,2; 14 0.75,2; 15 0.25,2; 16 -0.25,2; 17 -0.75,2; 18 -1.25,2 | smd 0.8 x 0.35: 7 2,-1.25; 8 2,-0.75; 9 2,-0.25; 10 2,0.25; 11 2,0.75; 12 2,1.25; 19 -2,1.25; 20 -2,0.75; 21 -2,0.25; 22 -2,-0.25; 23 -2,-0.75; 24 -2,-1.25
LGA14_2.5X3 = smd 0.25 x 0.675: 1 -0.75,-1.265; 2 -0.25,-1.265; 3 0.25,-1.265; 4 0.75,-1.265; 8 0.75,1.265; 9 0.25,1.265; 10 -0.25,1.265; 11 -0.75,1.265 | smd 0.675 x 0.25: 5 1.015,-0.5; 6 1.015,0; 7 1.015,0.5; 12 -1.015,0.5; 13 -1.015,0; 14 -1.015,-0.5
BM05B-SRSS = smd 0.6 x 1.55: 1 -2,-1.775; 2 -1,-1.775; 3 0,-1.775; 4 1,-1.775; 5 2,-1.775 | smd 1.2 x 1.8: S1 -3.6,0.75; S2 3.6,0.75
5040 = smd 1.6 x 4.5: 1 -2,0; 2 2,0
PM1 = smd 1 x 1: P$1 0,0
POWERPAK-SC70-6 = smd 0.3 x 0.325: 1 -0.65,-0.912; 2 0,-0.912; 3 0.65,-0.912; 4 0.65,0.912; 5 0,0.912; 6 -0.65,0.912 | smd 0.613 x 0.95: 7 -0.467,0; 8 0.467,0
SOT23 = smd 1 x 1.4: 1 -0.95,-1.1; 2 0.95,-1.1; 3 0,1.1
CAY16 = smd 0.5 x 0.9: 1 -1.2,-0.8; 2 -0.4,-0.8; 3 0.4,-0.8; 4 1.2,-0.8; 5 1.2,0.8; 6 0.4,0.8; 7 -0.4,0.8; 8 -1.2,0.8
WS-SLSV = smd 1.5 x 1.2: 1 -3.25,-2.5; 2 -3.25,0; 3 -3.25,2.5; 4 3.25,-2.5; 5 3.25,0; 6 3.25,2.5
WS-TRS-6X3.5 = smd 2.3 x 1.5: 1 -3.35,0; 2 3.35,0
WS-TASU = smd 1 x 1: 1 2.5,0.85; 2 2.5,-0.85; 3 -2.5,0.85; 4 -2.5,-0.85 | hole 0.85: 0,-1.375; 0,1.375
USB4105 = smd 0.6 x 1.15: A1_B12 3.2,-3.35; A4_B9 2.4,-3.35; B1_A12 -3.2,-3.35; B4_A9 -2.4,-3.35 | smd 0.3 x 1.15: A5 1.25,-3.35; A6 0.25,-3.35; A7 -0.25,-3.35; A8 -1.25,-3.35; B5 -1.75,-3.35; B6 -0.75,-3.35; B7 0.75,-3.35; B8 1.75,-3.35 | drill 0.6 pad 1 long: S1 -4.32,-2.78; S2 4.32,-2.78; S3 4.32,1.4; S4 -4.32,1.4 | hole 0.65: -2.89,-2.28; 2.89,-2.28
B4B-PH-SM4-TB = smd 1 x 5.5: 1 -1,-2.25; 2 1,-2.25 | smd 1.6 x 3: SH1 -2.9,0; SH2 2.9,0
BM04B-SRSS = smd 0.6 x 1.55: 1 -1.5,-1.775; 2 -0.5,-1.775; 3 0.5,-1.775; 4 1.5,-1.775 | smd 1.2 x 1.8: S1 -3.1,0.75; S2 3.1,0.75
BM02B-SRSS = smd 0.6 x 1.55: 1 -0.5,-1.775; 2 0.5,-1.775 | smd 1.2 x 1.8: S1 -2.1,0.75; S2 2.1,0.75
1X10-2.00-SMD = smd 0.86 x 1.8: 1 -9,-1.35; 2 -7,1.35; 3 -5,-1.35; 4 -3,1.35; 5 -1,-1.35; 6 1,1.35; 7 3,-1.35; 8 5,1.35; 9 7,-1.35; 10 9,1.35
MEM2051 = smd 0.8 x 1.5: 1 1.95,-4.15; 2 0.85,-3.75; 3 -0.25,-4.15; 4 -1.35,-4.35; 5 -2.45,-4.15; 6 -3.55,-4.35; 7 -4.65,-4.15; 8 -5.75,-4.15 | smd 1 x 0.95: 9 -3.55,6.925 | smd 1.4 x 1.9: S1 6.6,-7.45; S2 -6.55,-6.45 | smd 1.3 x 1.4: S3 0.75,6.7; S4 -4.95,6.7
1.4X1.5X5.2 = smd 0.6 x 1.1: 1 -0.6,0; 2 0.6,0 | smd 1.5 x 2.4: 3 0,5.55

### Placement (x,y rotation side)
C1  22.7,21.98 180 top
C2  22.71,23.93 180 top
C3  22.76,33.08 180 top
C4  11.05,26.25 180 top
C5  11.05,32.65 180 top
C6  22.75,31.53 180 top
C7  46.85,19.1 90 top
C8  45.5,19.55 90 top
C9  28.1,17.85 270 top
C10  37.5,34.6 0 top
C11  35.65,34.6 180 top
C12  13.9,29.45 180 top
C13  13.9,26.25 180 top
C14  41.3,33.4 90 top
C15  38,33.35 270 top
C16  70.4,10.85 270 top
C17  55.15,26.75 180 top
C18  17.4,64.25 270 top
C19  21.75,50.4 270 top
C20  19.3,48.85 0 top
C21  19.65,55.45 180 top
C22  17.5,48.85 180 top
C26  21.9,45.75 90 top
C27  18.4,43.5 180 top
C28  20.75,45.4 90 top
C29  22.1,55.15 180 top
D1  red  [0603N']  6.95,29 270 top
D2  14.65,27.85 180 top
D3  9.05,38.65 90 top
D4  66.5,12 90 top
D5  IN-S63DTLS  [0603N']  57,50 180 top
D6  green  [0603N']  6.95,32 270 top
F1  10.5,34.95 0 top
IC1  24,27.83 270 top
IC2  11.05,29 0 top
IC3  37,22 90 top
IC4  17.35,22.65 90 top
IC5  12.05,22.65 270 top
IC6  18.4,52.15 270 top
IC8  18.4,45.65 270 top
IC9  5,6 90 top
L1  20.17,27.84 90 top
L2  22.75,51.4 270 top
PM1  9,2 0 top
PM2  65,2 0 top
PM3  9,66 0 top
Q1  14.7,22.65 180 top
Q2  55.15,23.25 180 top
Q3  20.15,64.1 180 top
Q4  48.1,39.5 270 top
Q5  62.2,49.4 0 top
Q6  51,18.5 0 top
R1  8.3,29 270 top
R2  10.6,31.2 180 top
R3  27.25,17.85 90 top
R4  37,33.35 270 top
R5  36.15,33.35 270 top
R6  9.05,37.05 180 top
R7  9.05,40.25 180 top
R8  18.75,24.3 180 top
R9  11.5,19.7 90 top
R10  19.25,22.65 270 top
R11  10.6,19.7 90 top
R12  12.35,14 270 top
R13  42.4,33.4 270 top
R14  20.15,66.65 0 top
R15  44.95,35.35 0 top
R16  61.75,46.85 180 top
R17  56.65,48.45 180 top
R18  8.3,31.65 90 top
RN1  55.7,33.1 270 top
RN3  47.65,35.3 0 top
RN4  27.05,34.6 0 top
RN5  20.2,59.9 180 top
RN6  54.5,18.5 0 top
SW1  7.5,14.5 0 top
SW2  51,24.5 270 top
SW3  2.2,30.25 270 top
U$3  13.85,34.85 0 top
X1  3,39 90 top
X2  7.5,23 270 top
X3  55,39 270 top
X4  69,50 270 top
X5  62,39 270 top
X6  68.95,39 270 top
X7  5,61 90 top
X8  69,61 270 top
X9  5,49 90 top
X10  26,54 270 top
X11  48,54 90 top
X12  65,24.5 90 top
XT1  39.7,33.2 0 top

### Tracks (layer width: path | path; a pad name or v marks a point on that pad's centre or on a via)
+3V3  (via drill 0.3)
  Top 0.15: IC1.D5 IC1.C5 | R14.1 v17.4,66.65 | R16.1 v63.15,46.85
  Top 0.2: IC8.12 v18.9,47.45 | IC8.5 C27.2
  Top 0.3: v48.05,20.05 C7.2 C8.2 IC3.3 | R3.1 v26.5,17.35 | v42.4,34.6 R13.1 | Q2.2 C17.2 v54.2,28.2 | R15.1 v43.75,35.35 | X7.2 v8,60.5 | X8.2 v66,61.5 | RN5.1 RN5.2 RN5.3 RN5.4 v18.2,60.7 | v16.3,48.85 C22.2 17.65,49.5 IC6.8 | L2.1 22.75,54.95 C29.1 22.62,55.48 v22.62,56.2 | C27.2 v17.2,43.5 | RN6.1 v52.5,17.7 | Q6.5 v51,18.5
  Top 0.6: Q3.2 C18.1 v17.4,66.65 | Q5.2 v63.15,46.85 | C1.1 v23.65,20.7 v23.65,20 | Q4.2 47.3,38.25 v47.3,37.6
  pour Top (no thermals): 23.05,21.25 23.05,26.8 23.32,27.07 24.25,27.07 24.25,21.25
  pour Route15 (rank 2): 0,71 74,71 74,-3 0,-3
+5V  (via drill 0.3)
  Top 0.3: SW1.3 v6.1,17 | IC9.3 v8.15,6
  Bottom 0.3: v8.15,6 6.1,8.05 v6.1,17
BOOT
  Top 0.15: IC3.4 44.05,20.95 50.8,20.95 SW2.2
EN  (via drill 0.3, 0.35)
  Top 0.15: IC3.45 C9.1 | C9.1 R3.2 | Q6.2 51,17.1 50.9,17 49.95,17 v48.8,18.15 | v28.1,19.05 C9.1
  Top 0.152: SW3.3 3.05,30.79 2.82,30.56 2.82,29.94 3.05,29.71 SW3.1 5.9,27.75 6.35,27.3 v8.25,27.3 | v13.75,18.35 R3.2
  Bottom 0.15: v48.8,18.15 48.72,18.15 47.62,19.25 44.73,19.25 43.94,18.46 28.69,18.46 v28.1,19.05 | 8.5,22.55 8.25,22.8 v8.25,27.3
  Bottom 0.152: v13.75,18.35 12.7,18.35 8.5,22.55
ENABLE_3V3
  Top 0.15: IC1.D2 24.63,28.2 25.55,28.2 25.9,27.85 25.9,21.35 23.95,19.4 14.06,19.4 12.9,18.24 12.9,13.6 12.8,13.5 R12.2 12.35,11.7 8.65,8 IC9.5
GND  (via drill 0.3)
  Top 0.15: D2.1 15.4,28.1 15.3,28 14,28 13.9,28.1 D2.4 | IC1.D4 24.87,27.43 v25.35,26.95
  Top 0.2: C27.1 18.9,44 18.9,44.05 | 18.9,44.05 IC8.7 | IC8.6 18.4,44.15 18.5,44.05 18.9,44.05 | IC8.1 v16.3,46.4 16.3,45.9 | IC8.3 16.45,45.4 16.3,45.55 16.3,45.9 | IC8.2 16.3,45.9 | IC8.10 C28.2 | IC8.11 20.15,46.4 20.35,46.6 v20.75,46.6
  Top 0.3: IC3.2 45.35,19.2 C8.1 45.95,19.05 46.73,18.27 | 46.73,18.27 C7.1 | v48.05,18.15 C7.1 | C7.1 46.73,18.27 | IC3.1 v45.1,18.35 | v45.1,17.3 IC3.62 IC3.60 IC3.59 IC3.58 IC3.57 IC3.56 IC3.55 IC3.54 IC3.53 IC3.52 IC3.51 IC3.50 IC3.49 IC3.48 IC3.47 IC3.46 IC3.65 29.95,17.35 v28.9,17.35 C9.2 | IC3.42 v28.9,20.9 | IC3.43 v28.9,20.05 | IC3.64 v30,32.4 | IC3.30 v31.05,32.4 | IC3.63 44.05,31.35 v45.1,31.35 | D4.3 v62.9,13.65 | C17.1 v56.1,28.2 | X12.S3 58,25.55 v57.2,25.55 | X12.S4 v57.2,19.55 | SW2.1 v52.2,27.85 | X12.6 v70.55,20.95 | X12.S2 v70.1,17.95 | C16.1 v70.4,12 | X12.S1 v71.1,31.1 | C15.1 C10.2 v38,35.35 | C11.2 v35.15,33.85 | XT1.3 v39.7,37.05 | R17.1 v57.85,48.45 | IC6.9 18.15,49 C22.1 18,48.3 v18,48.1 | IC6.11 19.18,50.12 19.18,49.48 C20.2 v19.8,48.1 | C19.2 v21.75,49.25 | C21.1 v20.15,56.2 | IC6.18 v21.25,53.4 | IC6.1 v15.55,53.4 | C14.2 v41.3,34.6 | v52,40.5 X3.1 54.7,40.5 | v59,40.5 X5.1 62.15,40.5 | v65.95,40.5 X6.1 68.95,40.5 | X10.10 v26,45 | v8,59.5 X7.1 4.8,59.5 4.6,59.3 4.2,59.3 | v66,62.5 X8.1 69.2,62.5 69.25,62.55 | R7.1 v10.25,40.25 | R6.1 v10.25,37.05 | v9.25,32.65 C5.2 | R2.1 v11.1,30.15 | C13.2 13.3,26.35 v13.3,27.1 D2.5 | D2.4 13.9,28.95 C12.2 v13.4,30.2 | SW1.4 v10.75,10.95 | v20.95,31.9 21.53,31.9 C6.2 21.62,31.25 v20.95,31.25 | v20.95,32.75 21.58,32.75 C3.2 21.59,33.4 v20.95,33.4 | v20.65,22.35 21.38,22.35 C1.2 21.42,21.65 v20.65,21.65 | v20.65,24.3 21.39,24.3 C2.2 21.43,23.6 v20.65,23.6 | 69.2,51.5 X4.1 v66,51.5 | SW3.4 1.35,34.43 X1.S4 | SW3.2 1.35,26.8 | v35.35,27 IC3.70 34.35,25.95 v34.3,25.95 | v34.3,24.3 34.35,24.3 IC3.71 IC3.61 | v34.3,22.65 IC3.72 35.35,21.65 v35.35,21.6 | v37,21.6 IC3.73 IC3.61 | v38.35,21.6 38.35,22.75 IC3.66 38.6,22.95 v39.7,22.95
  Top 0.3: v39.7,24.3 IC3.67 IC3.61 | v38.65,27 IC3.68 v39.7,25.95 | v37,27 IC3.69 IC3.61 | R10.1 R8.1 v19.95,24.3 | D3.2 v9.05,38.65 | v21.25,56.2 C29.2 | v8.15,4 IC9.1 4.45,4 | C28.2 20.75,46.55 v20.75,46.6 C26.2 | C27.1 v19.6,43.5 | Q6.1 v50.25,18.5 | v9.9,19.2 R11.1 R9.1
  Top 0.6: 6.5,48.5 X9.1 7.15,48.5 | 6.5,48.5 v5.55,48.5 | v8,48.5 7.15,48.5 | v7.15,47.75 7.15,48.5 | v6.45,47.75 6.45,48.45 6.5,48.5 | X1.A1_B12 6.35,43.32 X1.S2 X1.S3 | X1.B1_A12 6.35,34.68 X1.S1 X1.S4 | C18.2 v17.4,62.2 | IC2.2 11.05,27.1 C4.2 9.25,26.25
  other vias: 22.05,27.85 21.35,27.85 21.7,28.45 21.7,27.25 20.95,27.25 20.95,28.45 5.6,46.9 5.6,51.1 5.5,20.5 5.5,25.6 5.5,26.35 5.5,19.8
  pour Top (rank 2, no thermals): 24.3,26.77 24.3,28.9 20.65,28.9 20.65,26.77
  pour Route2 (no thermals): 0,71 74,71 74,-3 0,-3
  pour Top (no thermals): 2.25,65.8 5.75,65.8 5.75,45.2 2.25,45.2
  pour Top (no thermals): 71.75,34.2 68.25,34.2 68.25,41.25 64.5,41.25 64.5,34.85 61.3,34.85 61.3,41.25 57.5,41.25 57.5,34.85 54.3,34.85 54.3,43 68.25,43 68.25,65.8 71.75,65.8
  pour Top (no thermals): 2.25,10.8 5.75,10.8 5.75,1.2 2.25,1.2
  pour Top (rank 2, no thermals): 0.9,27 9.25,27 9.25,19 0.9,19
  pour Route15 (no thermals): 1.6,43.8 1.05,43.8 arc90 0.55,43.3 arc90 1.05,42.8 1.6,42.8 2.15,42.8 arc90 2.65,43.3 arc90 2.15,43.8
  pour Route15 (no thermals): 5.8,43.8 5.25,43.8 arc90 4.75,43.3 arc90 5.25,42.8 5.8,42.8 6.35,42.8 arc90 6.85,43.3 arc90 6.35,43.8
  pour Route15 (no thermals): 5.8,35.2 5.25,35.2 arc90 4.75,34.7 arc90 5.25,34.2 5.8,34.2 6.35,34.2 arc90 6.85,34.7 arc90 6.35,35.2
  pour Route15 (no thermals): 1.6,35.2 1.05,35.2 arc90 0.55,34.7 arc90 1.05,34.2 1.6,34.2 2.15,34.2 arc90 2.65,34.7 arc90 2.15,35.2
I2C_INT  (via drill 0.3)
  Top 0.15: v23.8,36.95 23.8,35.9 24.35,35.35 24.35,32.95 26.55,30.75 26.55,21.4 28.75,19.2 IC3.44 | v21.75,48.5 20.85,49.4 19.85,49.4 19.65,49.6 IC6.12 | IC8.4 v16.3,44.9
  Bottom 0.15: v23.8,36.95 23.8,46.45 v21.75,48.5 18.15,44.9 v16.3,44.9
I2C_SCL  (via drill 0.3)
  Top 0.15: IC3.38 29.3,24.3 27.15,26.45 27.15,31.03 25,33.18 25,35.75 24.8,35.95 v24.8,36.95 | IC6.23 v17.65,55.5 16.95,55.5 15.05,53.6 15.05,49.4 16.85,47.6 18,47.6 18.4,47.2 IC8.13
  Bottom 0.15: v24.8,36.95 24.8,51.97 22.73,54.03 21.27,55.5 v17.65,55.5
I2C_SDA  (via drill 0.3)
  Top 0.15: IC3.41 29.04,21.75 28.4,22.39 28.4,24.78 26.85,26.33 26.85,30.9 24.7,33.05 24.7,35.45 24.3,35.85 v24.3,36.4 | v17.15,55 IC6.24 | IC8.14 17.9,47.2 17.8,47.3 16.7,47.3 14.75,49.25 v14.75,55
  Bottom 0.15: v24.3,36.4 24.3,37.05 24.3,52.05 21.35,55 v17.15,55 v14.75,55
IO2
  Top 0.15: IC3.6 45.39,22.6 50.02,27.23 50.02,29.23 52.29,31.5 52.69,31.9 RN1.4
IO3
  Top 0.15: IC3.7 45.77,23.45 49.73,27.4 49.73,29.36 53.07,32.7 RN1.3
IO4
  Top 0.15: IC3.8 46.2,24.3 49.42,27.52 49.42,29.48 53.44,33.5 RN1.2
IO5
  Top 0.15: IC3.9 46.62,25.15 49.12,27.65 49.12,29.61 53.82,34.3 RN1.1
IO6
  Top 0.15: IC3.10 47.02,26 48.83,27.8 48.83,34.48 RN3.4
IO7
  Top 0.15: IC3.11 47.42,26.85 48.52,27.95 48.52,29.8 48.52,32.67 48.05,33.15 RN3.3
IO_ENABLE  (via drill 0.3)
  Top 0.15: IC3.12 45.7,27.7 47.1,29.1 47.1,32.7 45.45,34.35 R15.2 45.45,39.15 v45.1,39.5 | v47,39.5 Q4.1
  Bottom 0.15: v45.1,39.5 v47,39.5
LED
  Top 0.15: IC3.5 49.37,21.75 50.17,22.55 51.95,22.55 53.3,21.2 53.3,20.05 53.3,19.4 | RN6.8 53.3,19.4 | Q6.4 53.3,19.4
N$1
  pour Top (no thermals): 24.3,27.35 24.3,27.5 22.7,27.5 21.8,26.6 17.95,26.6 17.95,25.1 22.35,25.1 22.35,26.55 23.15,27.35
N$2
  pour Top (no thermals): 24.3,28.18 24.3,28.3 23.15,28.3 22.4,29.05 22.4,30.6 17.95,30.6 17.95,29.1 21.75,29.1 22.7,28.18
N$3
  Top 0.15: RN1.6 62.75,32.7 65,34.95 65,37.8 65.7,38.5 X6.3
N$4
  Top 0.3: IC2.5 R2.2
N$5
  Top 0.15: IC3.20 39.55,32.5 39.17,32.88 | XT1.1 39.1,32.95 39.17,32.88 | C15.2 38.02,32.88 39.17,32.88
N$6
  Top 0.15: IC4.2 18.75,22.65 R10.2
N$7
  Top 0.15: R1.1 7.95,29.85 D1.C
N$8
  Top 0.15: IC2.1 8.45,27.85 8.3,28 R1.2
N$9
  Top 0.15: 36.98,34.62 C10.1
  Top 0.175: 7.4,39.2 8.3,39.2 D3.4 8.4,39.2 9.7,39.2 D3.3 10.12,39.15 10.45,38.83 33.67,38.83 36.8,35.7 36.8,34.8 36.98,34.62 | C10.1 R4.1 | 7.4,39.2 6.95,38.75 X1.A7 | X1.B7 6.9,39.75 7.4,39.25 7.4,39.2
N$10
  Top 0.175: R5.1 C11.1 36.35,34.8 36.35,35.5 33.5,38.35 10.35,38.35 10.15,38.15 D3.1 9.7,38.1 8.4,38.1 D3.6 8.3,38.1 7.4,38.1 7.25,38.25 X1.B6 5.65,38.25 5.55,38.35 5.55,39.15 5.65,39.25 X1.A6
N$11
  Top 0.15: X1.B5 8.35,37.25 R6.2
N$12
  Top 0.15: X1.A5 R7.2
N$13  (via drill 0.3)
  Top 0.3: D3.5 v7.6,38.65
  Top 0.6: X1.A4_B9 v7.6,41.4 7.6,46.95 8.77,48.12 8.77,48.88 8.15,49.5 X9.2 | X1.B4_A9 v7.6,36.6 9.1,35.1 F1.1
  Bottom 0.6: v7.6,36.6 v7.6,38.65 v7.6,41.4
N$14
  Top 0.15: IC5.2 10.75,22.65 10.6,22.5 R11.2
N$15  (via drill 0.3)
  Top 0.15: IC4.3 R8.2 17.65,24.9 v17.5,24.9 | v14.7,24.3 Q1.2
  Bottom 0.15: v17.5,24.9 15.3,24.9 v14.7,24.3
N$16  (via drill 0.3)
  Top 0.15: IC1.D1 24.55,28.63 | 24.55,28.63 IC1.C1 | IC1.D3 25.21,27.83 v25.35,27.7 | v25.35,28.7 25.28,28.63 24.55,28.63
  Top 0.3: v8.15,9 8.15,15.45 9.7,17 SW1.6 10.8,17.93 11,18.12 12.13,18.12 12.8,18.8 12.8,21.75 IC5.4 | IC9.4 v8.15,7
  Bottom 0.15: v25.35,27.7 v25.35,28.7
  Bottom 0.3: v8.15,7 v8.15,9
  pour Top (no thermals): 15.2,23.4 15.8,23.4 16,23.2 17.03,23.2 17.03,20.5 14.2,20.5 14.2,21.85 13.86,21.85 13.65,22.06 12.7,22.06 12.7,19.7 17.1,19.7 17.75,20.35 17.75,24.35 16.85,25.25 16.85,32.2 18.55,33.9 22.8,33.9 23.15,33.55 23.15,28.8 23.35,28.6 24.25,28.6 24.25,34.55 23.35,35.45 17.25,35.45 14.8,33 14.8,24.15 15.2,24.55
N$17  (via drill 0.3)
  Top 0.15: v14.7,21 Q1.5 | R9.2 v11.5,21 11.15,21.35 IC5.3
  Bottom 0.15: v11.5,21 v14.7,21
N$18
  Top 0.15: IC3.19 40.4,32.85 | 40.4,32.85 40.4,33.1 XT1.2 | C14.1 40.45,32.9 40.4,32.85
N$19
  Top 0.15: RN6.7 54.1,18.5 | Q6.3 51.75,18.3 51.95,18.5 53.95,18.5 54.05,18.5 54.1,18.5 | 54.1,18.5 59.1,18.5 62.35,15.25 62.35,10.8 62.8,10.35 D4.4
N$20  (via drill 0.3)
  Top 0.6: X3.2 v52,39.5 Q4.3 | v59,39.5 X5.2 | X6.2 v65.9,39.5
  Bottom 0.6: v52,39.5 v59,39.5 v65.9,39.5
N$21
  Top 0.3: IC6.10 18.68,50.12 18.68,49.08 18.8,48.95 C20.1
N$22  (via drill 0.3)
  Top 0.3: X12.4 v70.55,23.15 | v55.15,20.95 Q2.3
  Bottom 0.3: v70.55,23.15 57.35,23.15 v55.15,20.95
N$23
  Top 0.6: X10.1 Q3.3
N$24
  Top 0.6: Q5.3 X4.2
N$25
  Top 0.3: IC6.20 C21.2
N$27
  Top 0.15: R18.1 D6.A
N$31
  Top 0.15: X6.4 65.75,37.5 65.3,37.05 65.3,34.83 62.37,31.9 RN1.5
N$32
  Top 0.15: X5.3 58.85,38.5 58.2,37.85 58.2,35 57.5,34.3 RN1.8
N$33
  Top 0.15: RN1.7 57.12,33.5 58.5,34.88 58.5,37.05 58.95,37.5 X5.4
N$34
  Top 0.15: X3.4 49.4,37.5 48.85,36.95 RN3.5
N$35
  Top 0.15: X3.3 49.65,38.5 48.05,36.9 RN3.6
N$36
  Top 0.15: RN3.8 46.45,37.18 45.73,37.91 45.73,41.36 46.32,41.95 49.25,41.95 50.56,43.26 63.01,43.26 66.17,46.42 66.17,49.33 66.35,49.5 X4.3
N$37
  Top 0.15: RN3.7 47.25,36.81 46.02,38.03 46.02,39.45 46.02,41.23 46.44,41.65 49.37,41.65 50.68,42.96 63.13,42.96 67.22,47.05 X4.4
N$38  (via drill 0.3)
  Top 0.15: RN4.6 v27.45,36.85 | v23.6,57.4 21.4,57.4 | 21.4,57.4 13,57.4 7.9,62.5 X7.4 | X8.4 65.52,59.5 63.44,57.41 62.42,56.4 51.24,56.4 50.95,56.69 v50.95,57.4 | 21.4,57.4 RN5.8 RN5.7
  Bottom 0.15: v27.45,36.85 27.45,50.17 23.6,54.02 v23.6,57.4 v50.95,57.4
N$39  (via drill 0.3)
  Top 0.15: RN4.5 v28.25,36.35 | v24.15,56.9 v19,56.9 12.8,56.9 8.2,61.5 X7.3 | v51.45,56.9 62.5,56.9 66.1,60.5 X8.3 | RN5.6 RN5.5 v19,58.15
  Bottom 0.15: v28.25,36.35 28.25,49.79 24.15,53.89 v24.15,56.9 24.2,56.9 v51.45,56.9 | v19,58.15 v19,56.9
N$41
  Top 0.2: IC8.8 C28.1
  Top 0.3: IC6.13 C19.1 L2.2 22.75,45.05 22.6,44.9 C26.1 C28.1
N$42  (via drill 0.3)
  Top 0.15: v8.3,32.85 D6.C | Q6.6 50.12,19.52 v48.8,19.52
  Bottom 0.15: v48.8,19.52 48.74,19.52 47.74,19.52 44.61,19.52 44.19,19.11 28.72,19.11 28.3,19.52 27.9,19.52 26.63,18.25 14.56,18.25 13.96,18.85 12.59,18.85 9.75,21.69 9.75,31.4 v8.3,32.85
PD_ENABLE  (via drill 0.3)
  Top 0.15: v35.2,32.9 35.3,32.8 IC3.25 | v36.99,39.41 37.76,40.17 43.15,40.17 47.13,44.16 52.23,44.16 55.4,47.33 55.4,49.9 55.55,50.05 D5.A
  Bottom 0.15: v35.2,32.9 36.95,34.65 36.95,39 36.95,39.37 v36.99,39.41
PD_SENSE
  Top 0.15: IC3.18 41.25,31.98 41.88,32.61 41.88,38.48 47.26,43.86 52.35,43.86 56.15,47.66 R17.2 56.15,48.95 56.3,49.1 57.7,49.1 57.85,49.25 D5.C
QWIIC_SCL
  Top 0.15: IC3.36 29.3,26 27.75,27.55 27.75,32.1 27.45,32.4 RN4.3
QWIIC_SDA
  Top 0.15: IC3.35 29.35,26.85 28.05,28.15 28.05,33.6 RN4.4
SD_CS  (via drill 0.3)
  Top 0.15: IC3.14 v45.1,29.4 | v69.95,25.35 X12.2
  Bottom 0.15: v45.1,29.4 45.65,28.85 68.1,28.85 69.95,27 v69.95,25.35
SD_ENABLE  (via drill 0.3)
  Top 0.15: IC3.13 v45.1,28.55 | v56.1,25.55 Q2.1
  Bottom 0.15: v45.1,28.55 53.1,28.55 v56.1,25.55
SD_MISO  (via drill 0.3)
  Top 0.15: IC3.17 42.1,31.95 42.4,32.25 R13.2 44.96,32.9 v46.5,31.35 | v71.55,19.85 X12.7
  Bottom 0.15: v46.5,31.35 48.11,29.75 68.6,29.75 71.55,26.8 v71.55,19.85
SD_MOSI  (via drill 0.3)
  Top 0.15: X12.3 v70.5,24.25 | v45.1,30.25 IC3.15
  Bottom 0.15: v70.5,24.25 70.5,26.95 68.3,29.15 46.2,29.15 v45.1,30.25
SD_SCLK  (via drill 0.3)
  Top 0.15: IC3.16 42.95,32.06 43.19,32.3 44.86,32.3 45.6,31.56 45.6,31.55 v45.8,31.35 | v71.05,22.05 X12.5
  Bottom 0.15: v45.8,31.35 47.7,29.45 68.47,29.45 71.05,26.87 v71.05,22.05
UART_ENABLE  (via drill 0.3)
  Top 0.15: Q5.1 R16.2 61.25,45.2 59.61,43.56 50.09,43.56 v49.65,43.11 | v34.45,33.85 IC3.26
  Bottom 0.15: v34.45,33.85 34.45,37.62 38.92,42.08 39.95,43.11 v49.65,43.11
UART_RXD  (via drill 0.3)
  Top 0.15: v28.9,22.6 IC3.40 | RN3.1 46.45,33.8 47.4,32.85 47.4,27.65 v47.3,27.55
  Bottom 0.15: v28.9,22.6 33.85,27.55 v47.3,27.55
UART_TXD  (via drill 0.3)
  Top 0.15: v28.9,23.45 IC3.39 | v47.9,28.05 47.9,32.8 47.25,33.45 RN3.2
  Bottom 0.15: v28.9,23.45 33.5,28.05 v47.9,28.05
USB_D+
  Top 0.175: R5.2 IC3.24
USB_D-
  Top 0.175: IC3.23 R4.2
VBAT  (via drill 0.3)
  Top 0.3: D2.6 C13.1 14.4,25.25 14.35,25.25
  Top 0.6: IC2.3 12,26.35 C4.1
  Bottom 0.6: v16.1,21 15.43,21 15.43,21.77 14.5,22.7 13.1,22.7 12.6,23.2 v11.7,24.1 v11.7,24.85
  other vias: 15.4,21
  pour Top (no thermals): 16.7,22.1 15.9,22.1 15.9,22.85 15.65,23.1 14.85,23.1 14.85,20.8 16.7,20.8
  pour Top (no thermals): 11.45,26.75 11.45,24.9 2.6,24.9 2.6,23.55 10.65,23.55 10.65,23.85 12.4,23.85 12.4,25.1 14.5,25.1 14.5,25.7 12.35,25.7 12.35,26.75
VCC_LED  (via drill 0.3)
  Top 0.3: SW1.5 R12.1 v12.35,16.15 | D4.1 C16.2 70.4,9.8 70.1,9.5 63.1,9.5 61.95,10.65 61.95,15.1 59.35,17.7 v56.5,17.7 RN6.4 RN6.3 RN6.2
  Bottom 0.3: v56.5,17.7 55.95,17.15 48.27,17.15 46.52,18.9 44.87,18.9 43.87,17.9 14.11,17.9 12.51,16.3 v12.35,16.15
VUSB  (via drill 0.3)
  Top 0.15: D1.A 6.95,28.85 7.1,29 11.7,29 12,29 | R18.2 8.95,32.15 9.3,31.8 12,31.8 | D2.8 15.4,27.6 15.3,27.7 13.85,27.7 12.55,29 12,29 | IC2.4 12,29
  Top 0.3: D2.3 C12.1 | SW1.2 v5.45,14.5 6.45,14.5 10.55,18.6 11.95,18.6 12.35,19 12.35,22.94 12.54,23.12 12.68,23.12 IC5.6 12.95,23.75 12.8,23.9 | C12.1 14.4,29.9 | v14.4,30.2 C12.1 | IC9.2 v8.15,5
  Top 0.6: IC2.4 12,31.8 12,32.55 C5.1 | F1.2 C5.1 | 14.4,29.9 14.4,31 12.75,32.65 C5.1
  Bottom 0.3: v8.15,5 5.45,7.7 v5.45,14.5
  Bottom 0.6: v14.4,30.9 v14.4,30.2 14.4,26.77 13.98,26.35 13.98,24.32 v13.95,24.3 v13.25,24.3
  pour Top (no thermals): 12.7,22.4 13.8,22.4 13.95,22.25 14.55,22.25 14.55,23.1 14.3,23.1 14.3,24.8 12.7,24.8
XBEE_CS  (via drill 0.3)
  Top 0.15: IC3.29 v31.9,36.95 | v49.35,56.1 X11.7
  Bottom 0.15: v31.9,36.95 49.35,54.4 v49.35,56.1
XBEE_ENABLE  (via drill 0.3)
  Top 0.15: v22.15,65.2 Q3.1 21.1,66.2 R14.2 | IC3.37 29.3,25.15 27.45,27 27.45,31.15 25.3,33.3 25.3,36.1 v25.3,36.4
  Bottom 0.15: v22.15,65.2 22.98,64.38 23.1,64.25 23.1,54.09 25.3,51.89 v25.3,36.4
XBEE_INT  (via drill 0.3)
  Top 0.15: IC3.28 32.75,36.34 v32.78,36.37 | v46.65,44.5 X11.2
  Bottom 0.15: v32.78,36.37 40.91,44.5 v46.65,44.5
XBEE_MISO  (via drill 0.3)
  Top 0.15: IC3.33 29.35,28.55 28.65,29.25 28.65,32.61 30.4,34.36 v30.4,36.4 | v27.35,54.1 X10.4
  Bottom 0.15: v27.35,54.1 30.4,51.05 v30.4,36.4
XBEE_MOSI  (via drill 0.3)
  Top 0.15: IC3.31 29.4,30.25 29.25,30.4 29.25,32.36 31.4,34.51 v31.4,36.4 | v47.95,45 X11.1
  Bottom 0.15: v31.4,36.4 32.1,36.4 40.7,45 v47.95,45
XBEE_RESET  (via drill 0.3)
  Top 0.15: IC3.34 29.35,27.7 28.35,28.7 28.35,32.73 29.9,34.28 v29.9,36.95 | v24.65,54.1 X10.5
  Bottom 0.15: v29.9,36.95 29.9,48.85 v24.65,54.1
XBEE_RXD  (via drill 0.3)
  Top 0.15: v38.01,37.2 28.77,46.43 28.77,57.65 27.35,59.07 X10.2 | IC3.22 v37.85,32.17
  Bottom 0.15: v37.85,32.17 38.42,31.6 38.86,31.6 39.2,31.94 39.2,36.01 v38.01,37.2
XBEE_SCLK  (via drill 0.3)
  Top 0.15: IC3.32 29.4,29.4 28.95,29.85 28.95,32.48 30.9,34.43 v30.9,36.95 | v46.65,56.1 X11.8
  Bottom 0.15: v30.9,36.95 46.65,52.7 v46.65,56.1
XBEE_TXD  (via drill 0.3)
  Top 0.15: IC3.21 v38.7,32.15 | X10.3 27,59 28.48,57.52 28.48,46.02 v38,36.5
  Bottom 0.15: v38,36.5 38.7,35.8 v38.7,32.15

### Text on the board
tPlace: I2C | I2C | SCL | 1 | 20 | GND | SDA | 3V3 | 3V3 | SDA | GND | SCL | UART | Ext. 5V | IMU | XBEE | Light / Sensor | GND | 3V3 | 5V | RXD | GND | TXD | X / Y / Z | C | B | A | USB | GND | GND | GND | 3V3 | 3V3 | 3V3 | IO7 | IO5 | IO3 | IO6 | IO4 | IO2 | GPIO | Micro-SD | Boot- / Switch | Reset | GND | Battery | VBAT | senseBox | MCU 2.1 | RGB-LED | Off/On | EN_3V3 | VIN_ORED | 5V | VUSB | GND | Ext. On
bPlace: https://sensebox.de/go